# EAGLE schematic Mixed_signal_board (EAGLE 9.6.2)

## Sheet 1 of 7
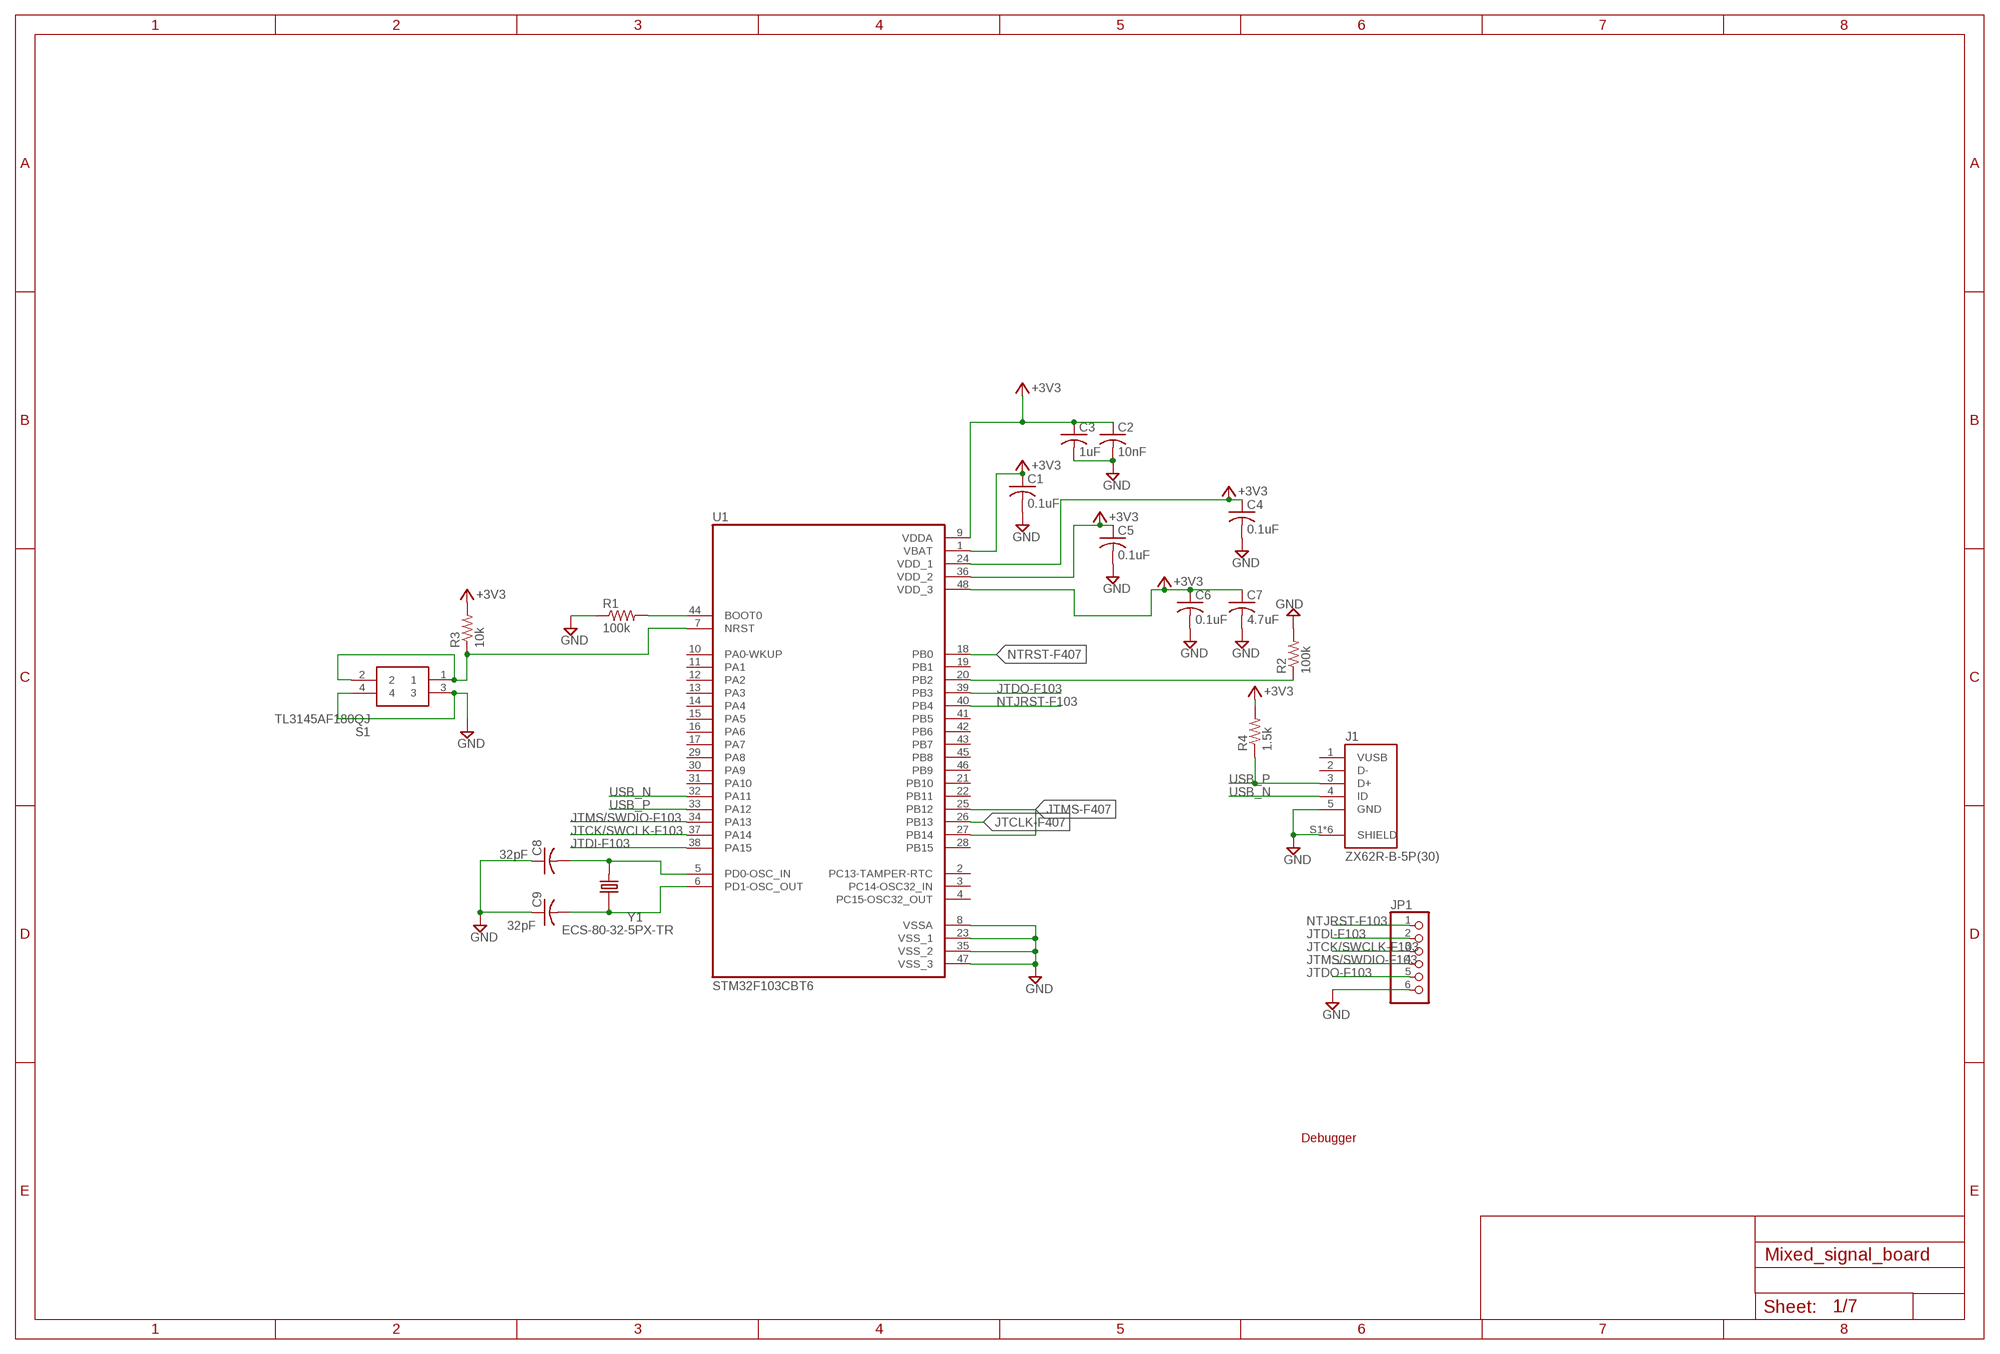
[diagram p0: schematic, sheet 1]

### Parts
C1  0.1uF  C-USC0805  [C0805]
C2  10nF  C-USC0805  [C0805]
C3  1uF  C-USC0805  [C0805]
C4  0.1uF  C-USC0805  [C0805]
C5  0.1uF  C-USC0805  [C0805]
C6  0.1uF  C-USC0805  [C0805]
C7  4.7uF  C-USC0805  [C0805]
C8  32pF  C-USC0805  [C0805]
C9  32pF  C-USC0805  [C0805]
J1  ZX62R-B-5P(30)  [HRS_ZX62R-B-5P(30)]
JP1  PINHD-1X6  [1X06]
R1  100k  R-US_R0805  [R0805]
R2  100k  R-US_R0805  [R0805]
R3  10k  R-US_R0805  [R0805]
R4  1.5k  R-US_R0805  [R0805]
S1  TL3145AF180QJ  [TL3145AF180QJ]
U1  STM32F103CBT6  [QFP50P900X900X160-48N]
Y1  ECS-80-32-5PX-TR  [XTAL_ECS-80-32-5PX-TR]

### Nets
+3V3: C1.1 C2.1 C3.1 C4.1 C5.1 C6.1 C7.1 R3.2 R4.2 U1.1(VBAT) U1.9(VDDA) U1.24(VDD_1) U1.36(VDD_2) U1.48(VDD_3) ; also sheet 2,3,4,5,6,7
GND: C1.2 C2.2 C3.2 C4.2 C5.2 C6.2 C7.2 C8.1 C9.1 J1.5(GND) J1.S1(SHIELD) J1.S2(SHIELD) J1.S3(SHIELD) J1.S4(SHIELD) J1.S5(SHIELD) J1.S6(SHIELD) JP1.6 R1.1 R2.2 S1.3 S1.4 U1.8(VSSA) U1.23(VSS_1) U1.35(VSS_2) U1.47(VSS_3) ; also sheet 2,3,4,5,6,7
JTCK/SWCLK-F103: JP1.3 U1.37(PA14)
JTCLK-F407: U1.26(PB13) ; also sheet 4
JTDI-F103: JP1.2 U1.38(PA15)
JTDO-F103: JP1.5 U1.39(PB3)
JTMS-F407: U1.25(PB12) U1.27(PB14) ; also sheet 4
JTMS/SWDIO-F103: JP1.4 U1.34(PA13)
N$1: R1.2 U1.44(BOOT0)
N$2: R2.1 U1.20(PB2)
N$3: C8.2 U1.5(PD0-OSC_IN) Y1.2
N$4: C9.2 U1.6(PD1-OSC_OUT) Y1.1
N$6: R3.1 S1.1 S1.2 U1.7(NRST)
NTJRST-F103: JP1.1 U1.40(PB4)
NTRST-F407: U1.18(PB0)
USB_N: J1.4(ID) U1.32(PA11)
USB_P: J1.3(D+) R4.1 U1.33(PA12)
Unconnected: J1.1(VUSB) J1.2(D-) U1.2(PC13-TAMPER-RTC) U1.3(PC14-OSC32_IN) U1.4(PC15-OSC32_OUT) U1.10(PA0-WKUP) U1.11(PA1) U1.12(PA2) U1.13(PA3) U1.14(PA4) U1.15(PA5) U1.16(PA6) U1.17(PA7) U1.19(PB1) U1.21(PB10) U1.22(PB11) U1.28(PB15) U1.29(PA8) U1.30(PA9) U1.31(PA10) U1.41(PB5) U1.42(PB6) U1.43(PB7) U1.45(PB8) U1.46(PB9)

### Notes on the sheet
- Debugger

## Sheet 2 of 7
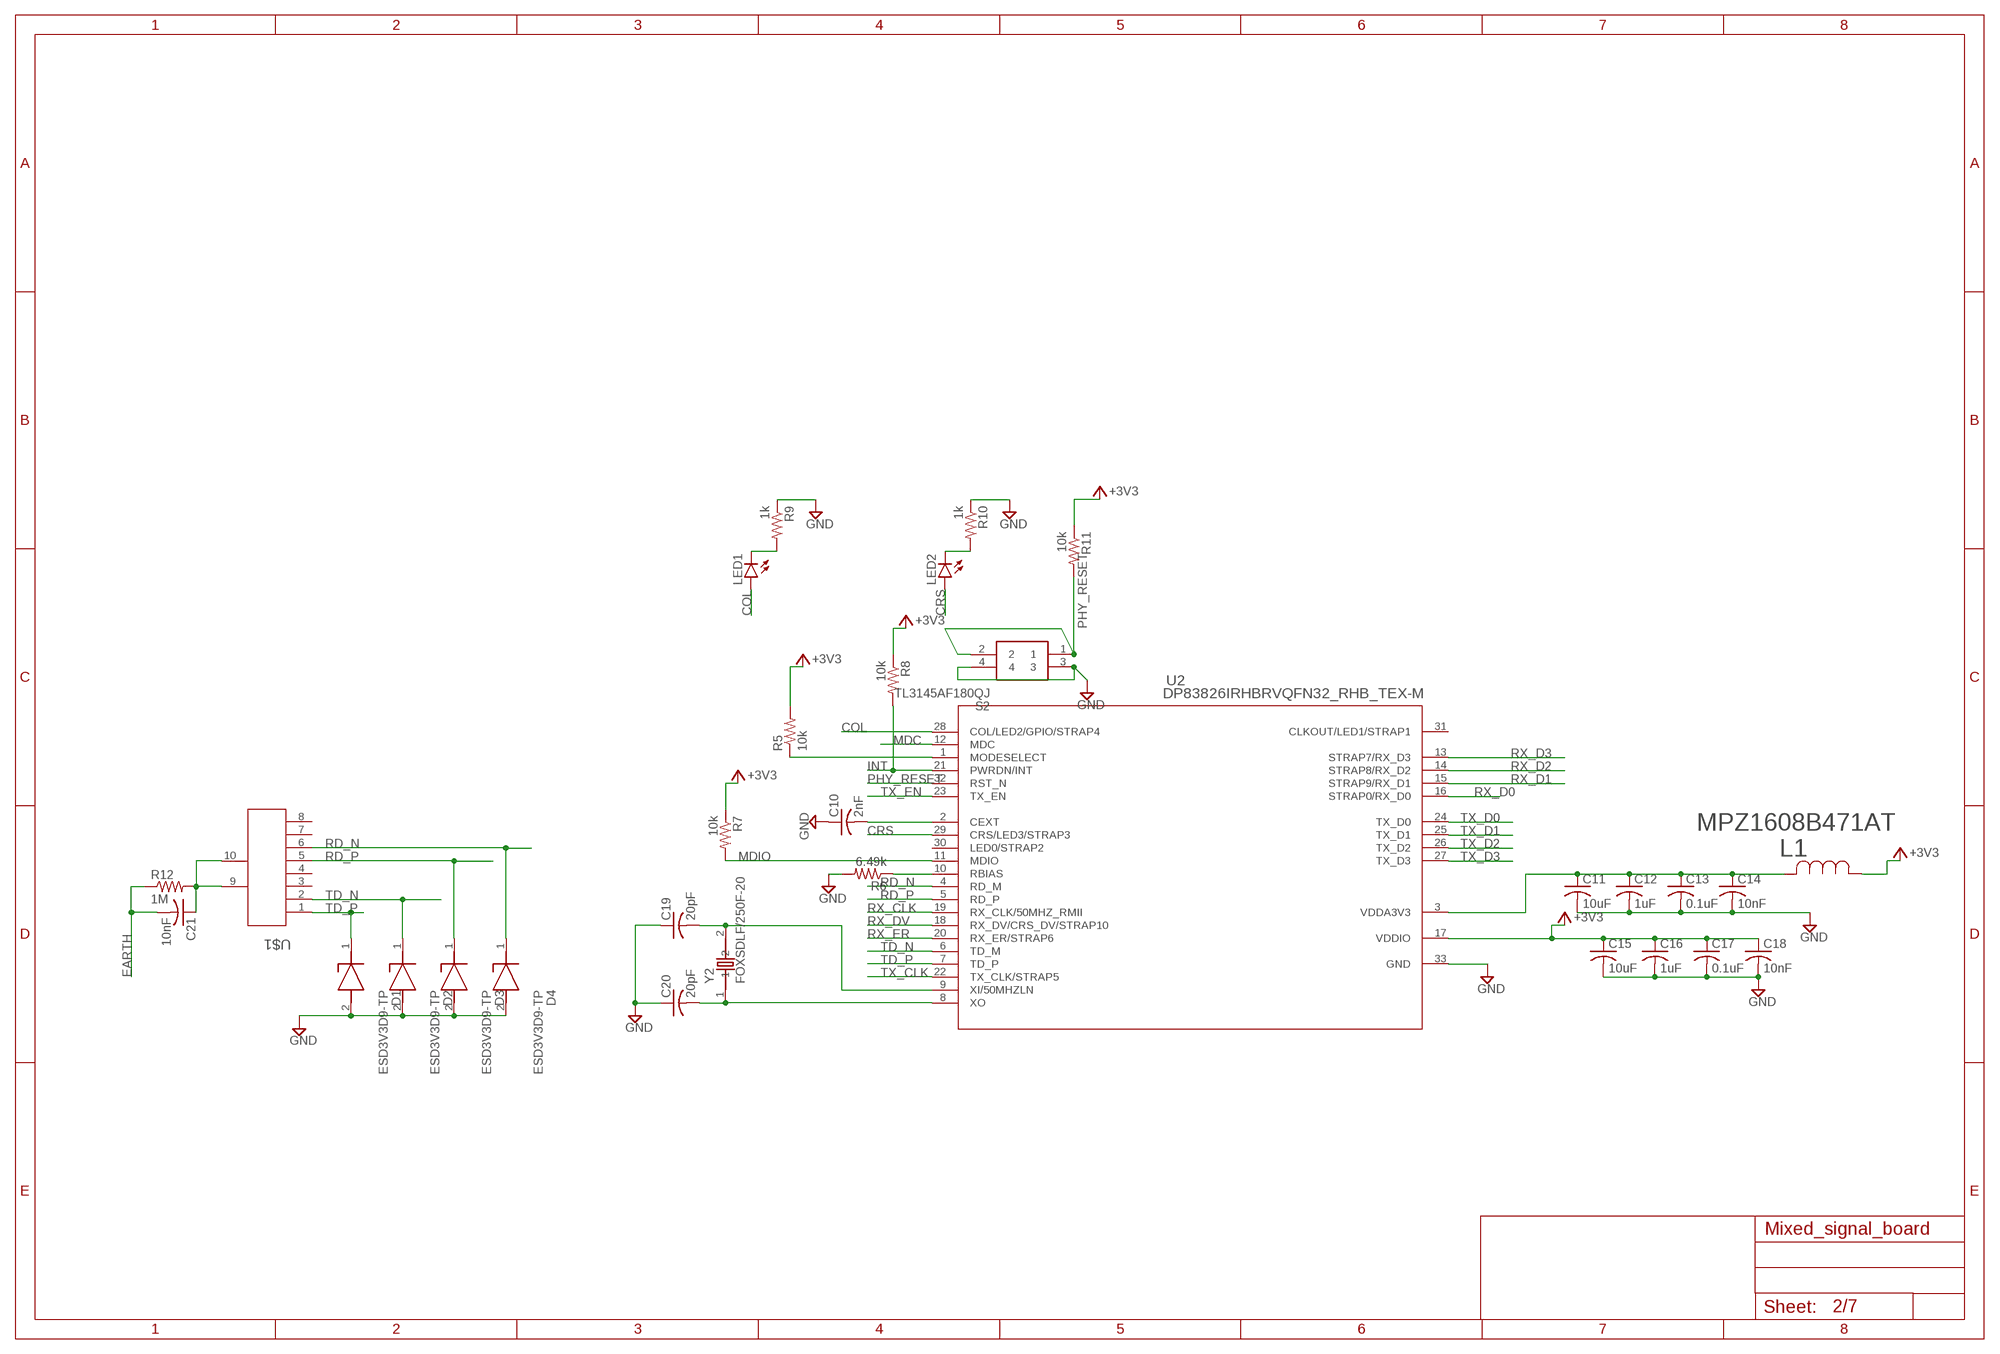
[diagram p1: schematic, sheet 2]

### Parts
C10  2nF  C-USC0805  [C0805]
C11  10uF  C-USC0805  [C0805]
C12  1uF  C-USC0805  [C0805]
C13  0.1uF  C-USC0805  [C0805]
C14  10nF  C-USC0805  [C0805]
C15  10uF  C-USC0805  [C0805]
C16  1uF  C-USC0805  [C0805]
C17  0.1uF  C-USC0805  [C0805]
C18  10nF  C-USC0805  [C0805]
C19  20pF  C-USC0805  [C0805]
C20  20pF  C-USC0805  [C0805]
C21  10nF  C-USC0805  [C0805]
D1  ESD3V3D9-TP  [SODFL1006X43N]
D2  ESD3V3D9-TP  [SODFL1006X43N]
D3  ESD3V3D9-TP  [SODFL1006X43N]
D4  ESD3V3D9-TP  [SODFL1006X43N]
L1  MPZ1608B471AT  [IND_MPZ1608_TDK]
LED1  LEDCHIPLED_0805  [CHIPLED_0805]
LED2  LEDCHIPLED_0805  [CHIPLED_0805]
R5  10k  R-US_R0805  [R0805]
R6  6.49k  R-US_R0805  [R0805]
R7  10k  R-US_R0805  [R0805]
R8  10k  R-US_R0805  [R0805]
R9  1k  R-US_R0805  [R0805]
R10  1k  R-US_R0805  [R0805]
R11  10k  R-US_R0805  [R0805]
R12  1M  R-US_R0805  [R0805]
S2  TL3145AF180QJ  [TL3145AF180QJ]
U2  DP83826IRHBRVQFN32_RHB_TEX-M  [VQFN32_RHB_TEX-M]
U$1  RJ-45  [CONN_RJSBE5080_16P13X12P57_AMP]
Y2  FOXSDLF/250F-20  [XTAL1170X500X450]

### Nets
+3V3: C15.1 C16.1 C17.1 C18.1 L1.1 R5.2 R7.1 R8.1 R11.1 U2.17(VDDIO) ; also sheet 1,3,4,5,6,7
COL: LED1.A U2.28(COL/LED2/GPIO/STRAP4) ; also sheet 4
CRS: LED2.A U2.29(CRS/LED3/STRAP3) ; also sheet 4
EARTH: C21.2 R12.1 ; also sheet 7
GND: C10.1 C11.2 C12.2 C13.2 C14.2 C15.2 C16.2 C17.2 C18.2 C19.1 C20.1 D1.2(A) D2.2(A) D3.2(A) D4.2(A) R6.2 R9.1 R10.1 S2.3 S2.4 U2.33(GND) ; also sheet 1,3,4,5,6,7
INT [50ohm]: R8.2 U2.21(PWRDN/INT)
MDC: U2.12(MDC) ; also sheet 4
MDIO: R7.2 U2.11(MDIO) ; also sheet 4
N$5: R5.1 U2.1(MODESELECT)
N$7: C10.2 U2.2(CEXT)
N$8: C11.1 C12.1 C13.1 C14.1 L1.2 U2.3(VDDA3V3)
N$9: C19.2 U2.9(XI/50MHZLN) Y2.2
N$10: C20.2 U2.8(XO) Y2.1
N$11: R6.1 U2.10(RBIAS)
N$12: C21.1 R12.2 U$1.9(EARTH) U$1.10(EARTH2)
N$13: LED1.C R9.2
N$14: LED2.C R10.2
PHY_RESET: R11.2 S2.1 S2.2 U2.32(RST_N) ; also sheet 4
RD_N: D4.1(K) U2.4(RD_M) U$1.6(D3-)
RD_P: D3.1(K) U2.5(RD_P) U$1.5(D3+)
RX_CLK [50ohm]: U2.19(RX_CLK/50MHZ_RMII) ; also sheet 4
RX_D0 [50ohm]: U2.16(STRAP0/RX_D0) ; also sheet 4
RX_D1 [50ohm]: U2.15(STRAP9/RX_D1) ; also sheet 4
RX_D2 [50ohm]: U2.14(STRAP8/RX_D2) ; also sheet 4
RX_D3 [50ohm]: U2.13(STRAP7/RX_D3) ; also sheet 4
RX_DV [50ohm]: U2.18(RX_DV/CRS_DV/STRAP10) ; also sheet 4
RX_ER [50ohm]: U2.20(RX_ER/STRAP6)
TD_N: D2.1(K) U2.6(TD_M) U$1.2(D1-)
TD_P: D1.1(K) U2.7(TD_P) U$1.1(D1+)
TX_CLK [50ohm]: U2.22(TX_CLK/STRAP5) ; also sheet 4
TX_D0 [50ohm]: U2.24(TX_D0) ; also sheet 4
TX_D1 [50ohm]: U2.25(TX_D1) ; also sheet 4
TX_D2 [50ohm]: U2.26(TX_D2) ; also sheet 4
TX_D3 [50ohm]: U2.27(TX_D3) ; also sheet 4
TX_EN [50ohm]: U2.23(TX_EN) ; also sheet 4
Unconnected: U2.30(LED0/STRAP2) U2.31(CLKOUT/LED1/STRAP1) U$1.3(D2+) U$1.4(D2-) U$1.7(D4+) U$1.8(D4-)

## Sheet 3 of 7
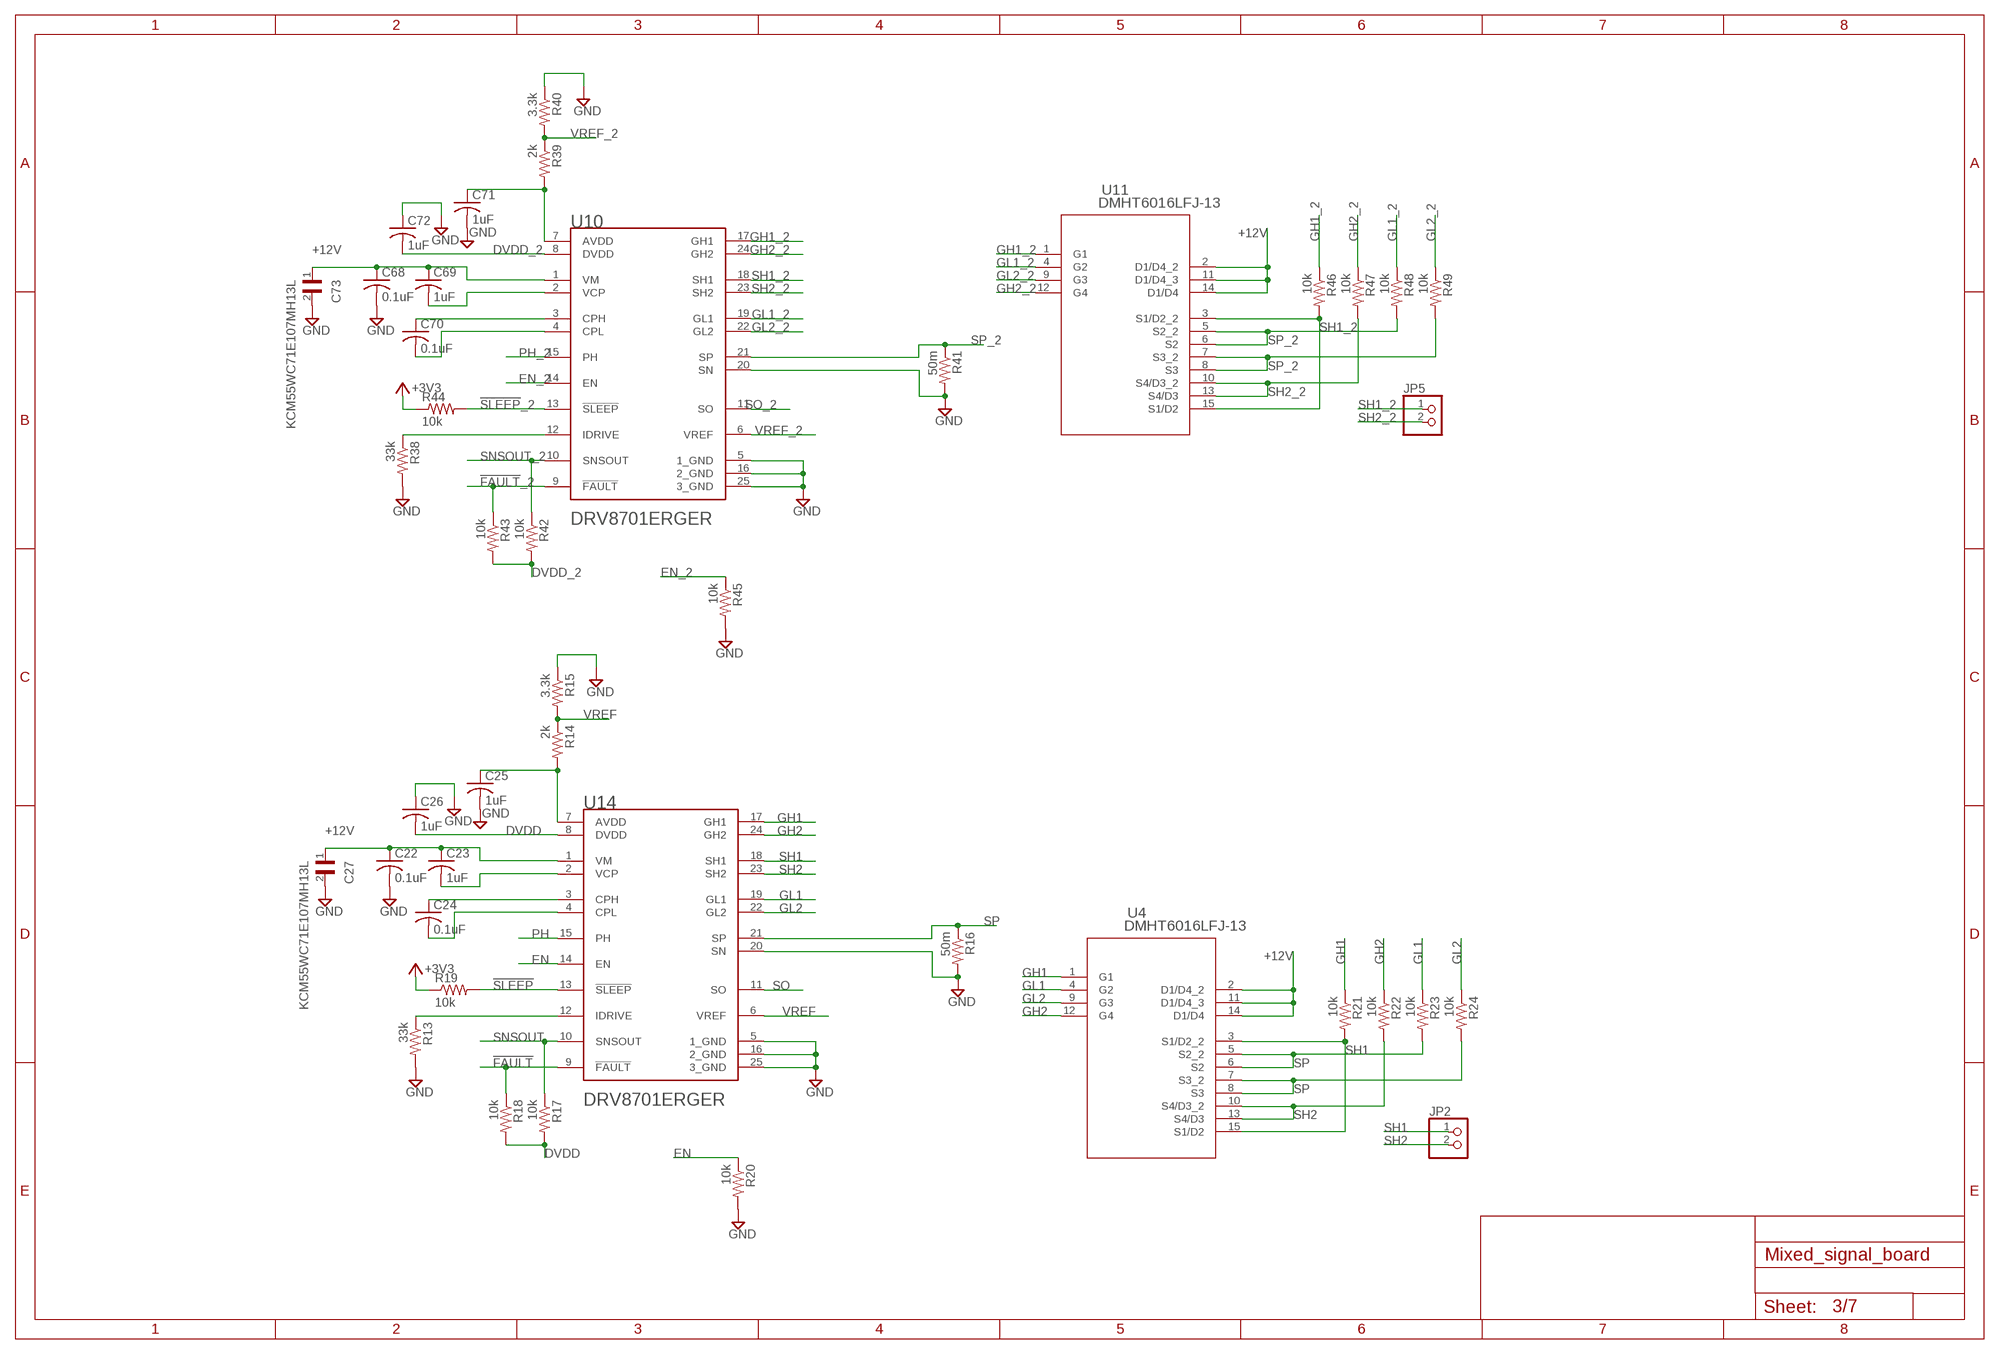
[diagram p2: schematic, sheet 3]

### Parts
C22  0.1uF  C-USC0805  [C0805]
C23  1uF  C-USC0805  [C0805]
C24  0.1uF  C-USC0805  [C0805]
C25  1uF  C-USC0805  [C0805]
C26  1uF  C-USC0805  [C0805]
C27  KCM55WC71E107MH13L  [CAPC6153X670N]
C68  0.1uF  C-USC0805  [C0805]
C69  1uF  C-USC0805  [C0805]
C70  0.1uF  C-USC0805  [C0805]
C71  1uF  C-USC0805  [C0805]
C72  1uF  C-USC0805  [C0805]
C73  KCM55WC71E107MH13L  [CAPC6153X670N]
JP2  PINHD-1X2  [1X02]
JP5  PINHD-1X2  [1X02]
R13  33k  R-US_R0805  [R0805]
R14  2k  R-US_R0805  [R0805]
R15  3.3k  R-US_R0805  [R0805]
R16  50m  R-US_R0805  [R0805]
R17  10k  R-US_R0805  [R0805]
R18  10k  R-US_R0805  [R0805]
R19  10k  R-US_R0805  [R0805]
R20  10k  R-US_R0805  [R0805]
R21  10k  R-US_R0805  [R0805]
R22  10k  R-US_R0805  [R0805]
R23  10k  R-US_R0805  [R0805]
R24  10k  R-US_R0805  [R0805]
R38  33k  R-US_R0805  [R0805]
R39  2k  R-US_R0805  [R0805]
R40  3.3k  R-US_R0805  [R0805]
R41  50m  R-US_R0805  [R0805]
R42  10k  R-US_R0805  [R0805]
R43  10k  R-US_R0805  [R0805]
R44  10k  R-US_R0805  [R0805]
R45  10k  R-US_R0805  [R0805]
R46  10k  R-US_R0805  [R0805]
R47  10k  R-US_R0805  [R0805]
R48  10k  R-US_R0805  [R0805]
R49  10k  R-US_R0805  [R0805]
U4  DMHT6016LFJ-13  [QFN_LFJ-13_DIO]
U10  TEXAS_INSTRUMENTS_DRV8701ERGERTEXAS_INSTRUMENTS_DRV8701ERGER_0_0  [TEXAS_INSTRUMENTS_DRV8701ERGER_0]
U11  DMHT6016LFJ-13  [QFN_LFJ-13_DIO]
U14  TEXAS_INSTRUMENTS_DRV8701ERGERTEXAS_INSTRUMENTS_DRV8701ERGER_0_0  [TEXAS_INSTRUMENTS_DRV8701ERGER_0]

### Nets
!FAULT!: R18.1 U14.9(!FAULT!) ; also sheet 4
!FAULT!_2: R43.1 U10.9(!FAULT!) ; also sheet 4
!SLEEP!: R19.2 U14.13(!SLEEP!)
!SLEEP!_2: R44.2 U10.13(!SLEEP!)
+3V3: R19.1 R44.1 ; also sheet 1,2,4,5,6,7
+12V: C22.1 C23.1 C27.1 C68.1 C69.1 C73.1 U4.2(D1/D4_2) U4.11(D1/D4_3) U4.14(D1/D4) U10.1(VM) U11.2(D1/D4_2) U11.11(D1/D4_3) U11.14(D1/D4) U14.1(VM) ; also sheet 7
DVDD: C26.2 R17.2 R18.2 U14.8(DVDD)
DVDD_2: C72.2 R42.2 R43.2 U10.8(DVDD)
EN: R20.1 U14.14(EN) ; also sheet 4
EN_2: R45.1 U10.14(EN) ; also sheet 4
GH1: R21.1 U4.1(G1) U14.17(GH1)
GH1_2: R46.1 U10.17(GH1) U11.1(G1)
GH2: R22.1 U4.12(G4) U14.24(GH2)
GH2_2: R47.1 U10.24(GH2) U11.12(G4)
GL1: R23.1 U4.4(G2) U14.19(GL1)
GL1_2: R48.1 U10.19(GL1) U11.4(G2)
GL2: R24.1 U4.9(G3) U14.22(GL2)
GL2_2: R49.1 U10.22(GL2) U11.9(G3)
GND: C22.2 C25.2 C26.1 C27.2 C68.2 C71.2 C72.1 C73.2 R13.2 R15.1 R16.2 R20.2 R38.2 R40.1 R41.2 R45.2 U10.5(1_GND) U10.16(2_GND) U10.20(SN) U10.25(3_GND) U14.5(1_GND) U14.16(2_GND) U14.20(SN) U14.25(3_GND) ; also sheet 1,2,4,5,6,7
N$16: C23.2 U14.2(VCP)
N$17: C24.1 U14.3(CPH)
N$18: C24.2 U14.4(CPL)
N$19: R13.1 U14.12(IDRIVE)
N$20: C25.1 R14.2 U14.7(AVDD)
N$39: C69.2 U10.2(VCP)
N$40: C70.1 U10.3(CPH)
N$41: C70.2 U10.4(CPL)
N$42: R38.1 U10.12(IDRIVE)
N$43: C71.1 R39.2 U10.7(AVDD)
PH: U14.15(PH) ; also sheet 4
PH_2: U10.15(PH) ; also sheet 4
SH1: JP2.1 R21.2 U4.3(S1/D2_2) U4.15(S1/D2) U14.18(SH1)
SH1_2: JP5.1 R46.2 U10.18(SH1) U11.3(S1/D2_2) U11.15(S1/D2)
SH2: JP2.2 R22.2 U4.10(S4/D3_2) U4.13(S4/D3) U14.23(SH2)
SH2_2: JP5.2 R47.2 U10.23(SH2) U11.10(S4/D3_2) U11.13(S4/D3)
SNSOUT: R17.1 U14.10(SNSOUT) ; also sheet 4
SNSOUT_2: R42.1 U10.10(SNSOUT) ; also sheet 4
SO: U14.11(SO) ; also sheet 4
SO_2: U10.11(SO) ; also sheet 4
SP: R16.1 R23.2 R24.2 U4.5(S2_2) U4.6(S2) U4.7(S3_2) U4.8(S3) U14.21(SP)
SP_2: R41.1 R48.2 R49.2 U10.21(SP) U11.5(S2_2) U11.6(S2) U11.7(S3_2) U11.8(S3)
VREF: R14.1 R15.2 U14.6(VREF)
VREF_2: R39.1 R40.2 U10.6(VREF)

## Sheet 4 of 7
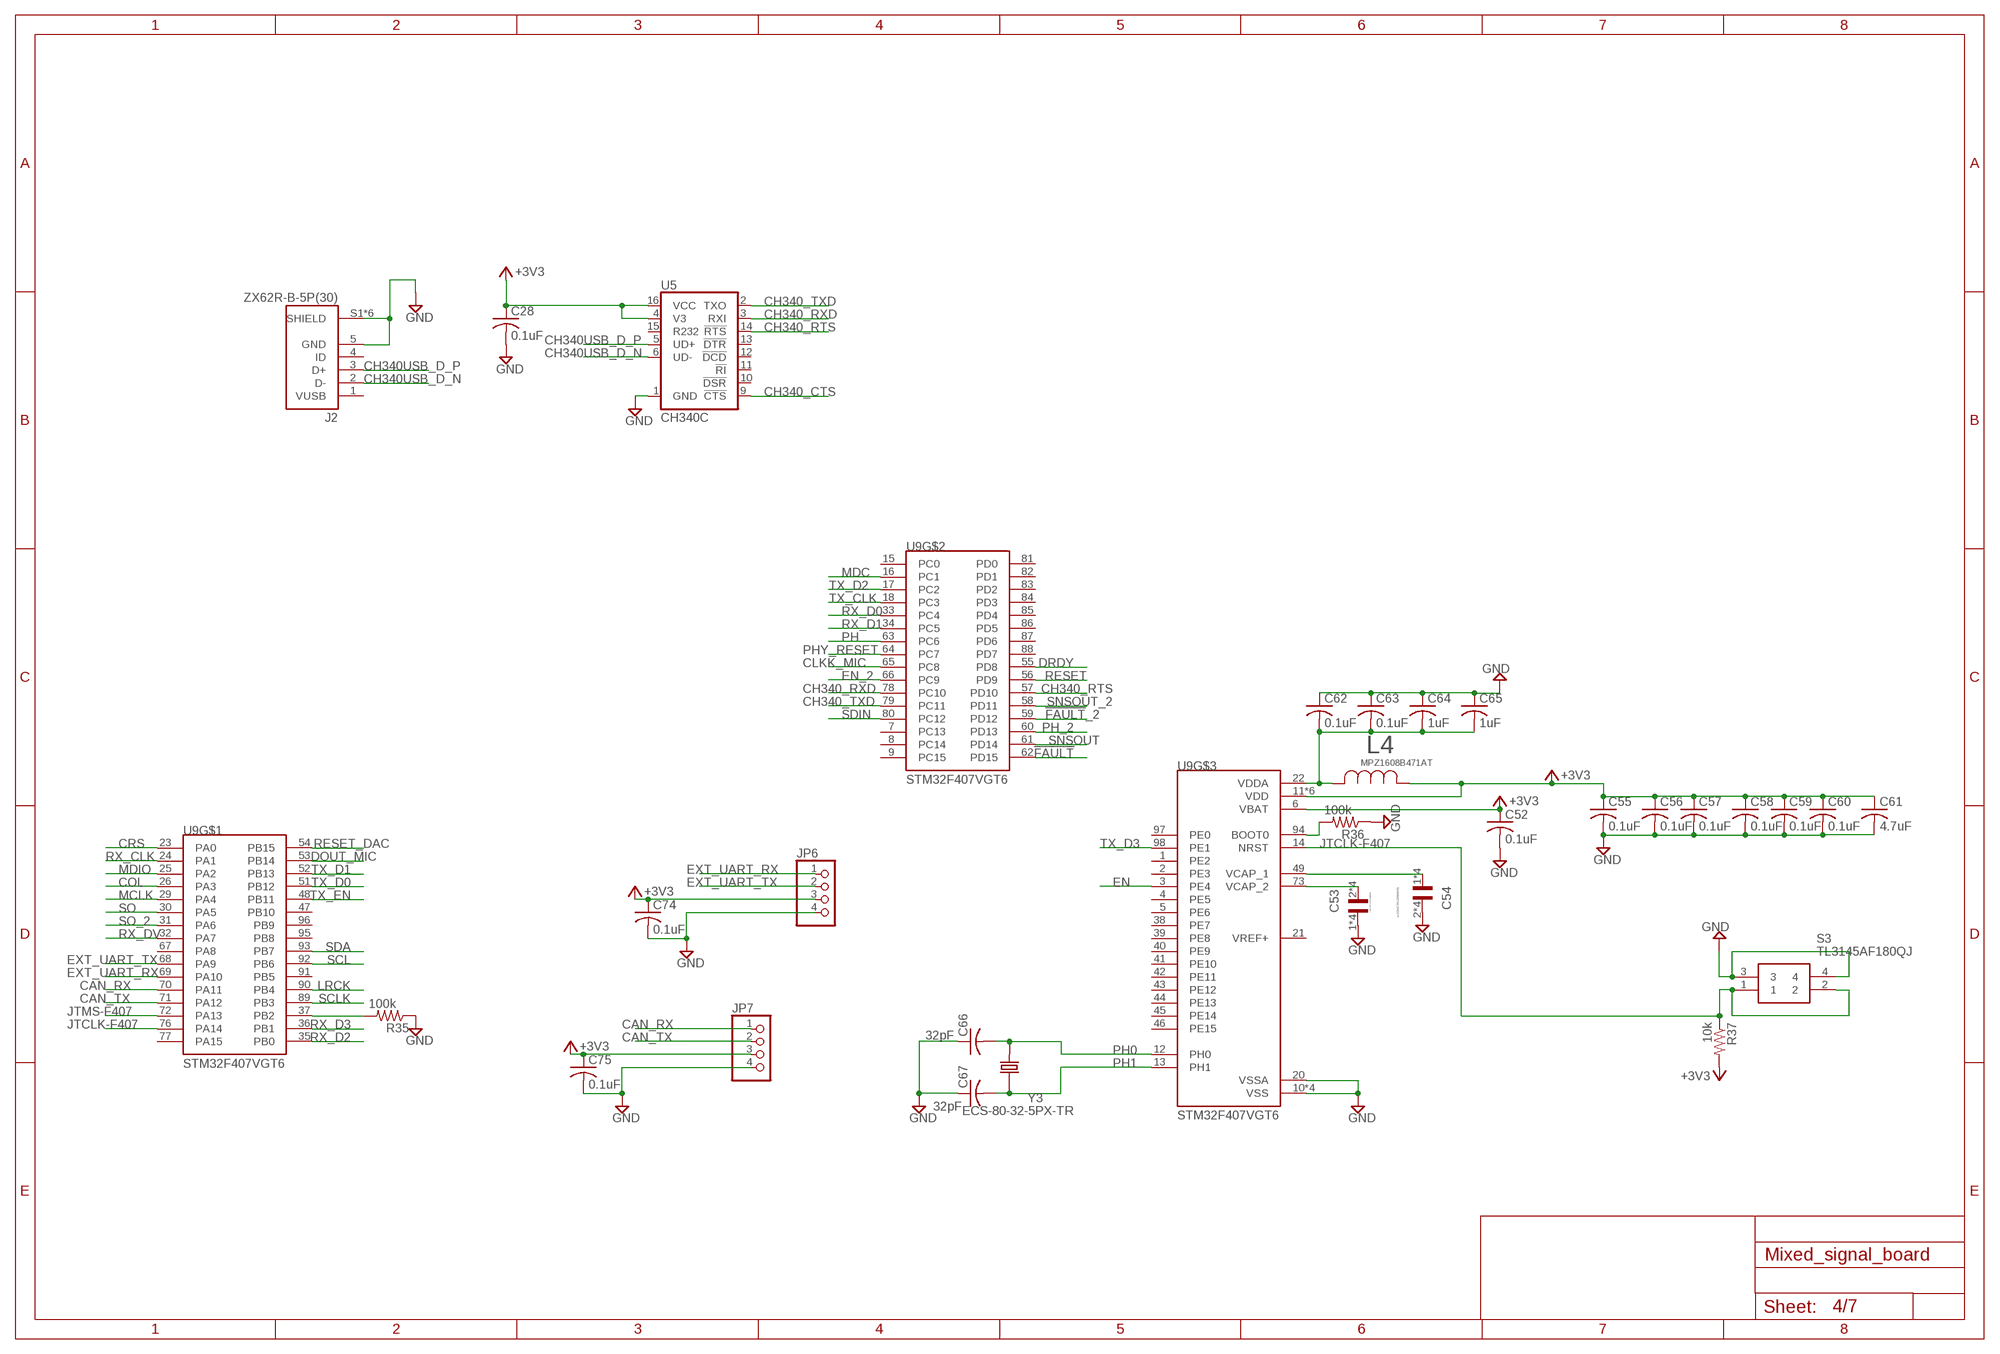
[diagram p3: schematic, sheet 4]

### Parts
C28  0.1uF  C-USC0805  [C0805]
C52  0.1uF  C-USC0805  [C0805]
C53  LLA219C70G225MA01L  [CAP_LLA219C70G225MA01L]
C54  LLA219C70G225MA01L  [CAP_LLA219C70G225MA01L]
C55  0.1uF  C-USC0805  [C0805]
C56  0.1uF  C-USC0805  [C0805]
C57  0.1uF  C-USC0805  [C0805]
C58  0.1uF  C-USC0805  [C0805]
C59  0.1uF  C-USC0805  [C0805]
C60  0.1uF  C-USC0805  [C0805]
C61  4.7uF  C-USC0805  [C0805]
C62  0.1uF  C-USC0805  [C0805]
C63  0.1uF  C-USC0805  [C0805]
C64  1uF  C-USC0805  [C0805]
C65  1uF  C-USC0805  [C0805]
C66  32pF  C-USC0805  [C0805]
C67  32pF  C-USC0805  [C0805]
C74  0.1uF  C-USC0805  [C0805]
C75  0.1uF  C-USC0805  [C0805]
J2  ZX62R-B-5P(30)  [HRS_ZX62R-B-5P(30)]
JP6  PINHD-1X4  [1X04]
JP7  PINHD-1X4  [1X04]
L4  MPZ1608B471AT  [IND_MPZ1608_TDK]
R35  100k  R-US_R0805  [R0805]
R36  100k  R-US_R0805  [R0805]
R37  10k  R-US_R0805  [R0805]
S3  TL3145AF180QJ  [TL3145AF180QJ]
U5  CH340C  [SO016]
U9  STM32F407VGT6  [QFP50P1600X1600X160-100N]
Y3  ECS-80-32-5PX-TR  [XTAL_ECS-80-32-5PX-TR]

### Nets
!FAULT!: U9.62(PD15) ; also sheet 3
!FAULT!_2: U9.59(PD12) ; also sheet 3
+3V3: C28.1 C52.1 C55.1 C56.1 C57.1 C58.1 C59.1 C60.1 C61.1 C74.1 C75.1 JP6.3 JP7.3 L4.1 R37.2 U5.4(V3) U5.16(VCC) U9.6(VBAT) U9.11(VDD) U9.19(VDD) U9.28(VDD) U9.50(VDD) U9.75(VDD) U9.100(VDD) ; also sheet 1,2,3,5,6,7
CAN_RX: JP7.1 U9.70(PA11)
CAN_TX: JP7.2 U9.71(PA12)
CH340_CTS: U5.9(!CTS)
CH340_RTS: U5.14(!RTS) U9.57(PD10)
CH340_RXD: U5.3(RXI) U9.78(PC10)
CH340_TXD: U5.2(TXO) U9.79(PC11)
CH340USB_D_N: J2.2(D-) U5.6(UD-) ; also sheet 5
CH340USB_D_P: J2.3(D+) U5.5(UD+) ; also sheet 5
CLKK_MIC: U9.65(PC8) ; also sheet 6
COL: U9.26(PA3) ; also sheet 2
CRS: U9.23(PA0) ; also sheet 2
DOUT_MIC: U9.53(PB14) ; also sheet 6
DRDY: U9.55(PD8) ; also sheet 5
EN: U9.3(PE4) ; also sheet 3
EN_2: U9.66(PC9) ; also sheet 3
EXT_UART_RX: JP6.1 U9.69(PA10)
EXT_UART_TX: JP6.2 U9.68(PA9)
GND: C28.2 C52.2 C53.1 C53.3 C53.5 C53.7 C54.2 C54.4 C54.6 C54.8 C55.2 C56.2 C57.2 C58.2 C59.2 C60.2 C61.2 C62.1 C63.1 C64.1 C65.1 C66.1 C67.1 C74.2 C75.2 J2.5(GND) J2.S1(SHIELD) J2.S2(SHIELD) J2.S3(SHIELD) J2.S4(SHIELD) J2.S5(SHIELD) J2.S6(SHIELD) JP6.4 JP7.4 R35.1 R36.1 S3.3 S3.4 U5.1(GND) U9.10(VSS) U9.20(VSSA) U9.27(VSS) U9.74(VSS) U9.99(VSS) ; also sheet 1,2,3,5,6,7
JTCLK-F407: R37.1 S3.1 S3.2 U9.14(NRST) U9.76(PA14) ; also sheet 1
JTMS-F407: U9.72(PA13) ; also sheet 1
LRCK: U9.90(PB4) ; also sheet 6
MCLK: U9.29(PA4) ; also sheet 6
MDC: U9.16(PC1) ; also sheet 2
MDIO: U9.25(PA2) ; also sheet 2
N$34: R36.2 U9.94(BOOT0)
N$35: C54.1 C54.3 C54.5 C54.7 U9.49(VCAP_1)
N$36: C53.2 C53.4 C53.6 C53.8 U9.73(VCAP_2)
N$37: C62.2 C63.2 C64.2 C65.2 L4.2 U9.22(VDDA)
N$46: R35.2 U9.37(PB2)
PH: U9.63(PC6) ; also sheet 3
PH0: C66.2 U9.12(PH0) Y3.2
PH1: C67.2 U9.13(PH1) Y3.1
PH_2: U9.60(PD13) ; also sheet 3
PHY_RESET: U9.64(PC7) ; also sheet 2
RESET: U9.56(PD9) ; also sheet 5
RESET_DAC: U9.54(PB15) ; also sheet 6
RX_CLK [50ohm]: U9.24(PA1) ; also sheet 2
RX_D0 [50ohm]: U9.33(PC4) ; also sheet 2
RX_D1 [50ohm]: U9.34(PC5) ; also sheet 2
RX_D2 [50ohm]: U9.35(PB0) ; also sheet 2
RX_D3 [50ohm]: U9.36(PB1) ; also sheet 2
RX_DV [50ohm]: U9.32(PA7) ; also sheet 2
SCL: U9.92(PB6) ; also sheet 5,6
SCLK: U9.89(PB3) ; also sheet 6
SDA: U9.93(PB7) ; also sheet 5,6
SDIN: U9.80(PC12) ; also sheet 6
SNSOUT: U9.61(PD14) ; also sheet 3
SNSOUT_2: U9.58(PD11) ; also sheet 3
SO: U9.30(PA5) ; also sheet 3
SO_2: U9.31(PA6) ; also sheet 3
TX_CLK [50ohm]: U9.18(PC3) ; also sheet 2
TX_D0 [50ohm]: U9.51(PB12) ; also sheet 2
TX_D1 [50ohm]: U9.52(PB13) ; also sheet 2
TX_D2 [50ohm]: U9.17(PC2) ; also sheet 2
TX_D3 [50ohm]: U9.98(PE1) ; also sheet 2
TX_EN [50ohm]: U9.48(PB11) ; also sheet 2
Unconnected: J2.1(VUSB) J2.4(ID) U5.10(!DSR) U5.11(!RI) U5.12(!DCD) U5.13(!DTR) U5.15(R232) U9.1(PE2) U9.2(PE3) U9.4(PE5) U9.5(PE6) U9.7(PC13) U9.8(PC14) U9.9(PC15) U9.15(PC0) U9.38(PE7) U9.39(PE8) U9.40(PE9) U9.41(PE10) U9.42(PE11) U9.43(PE12) U9.44(PE13) U9.45(PE14) U9.46(PE15) U9.47(PB10) U9.67(PA8) U9.77(PA15) U9.81(PD0) U9.82(PD1) U9.83(PD2) U9.84(PD3) U9.85(PD4) U9.86(PD5) U9.87(PD6) U9.88(PD7) U9.91(PB5) U9.95(PB8) U9.96(PB9) U9.97(PE0)

## Sheet 5 of 7
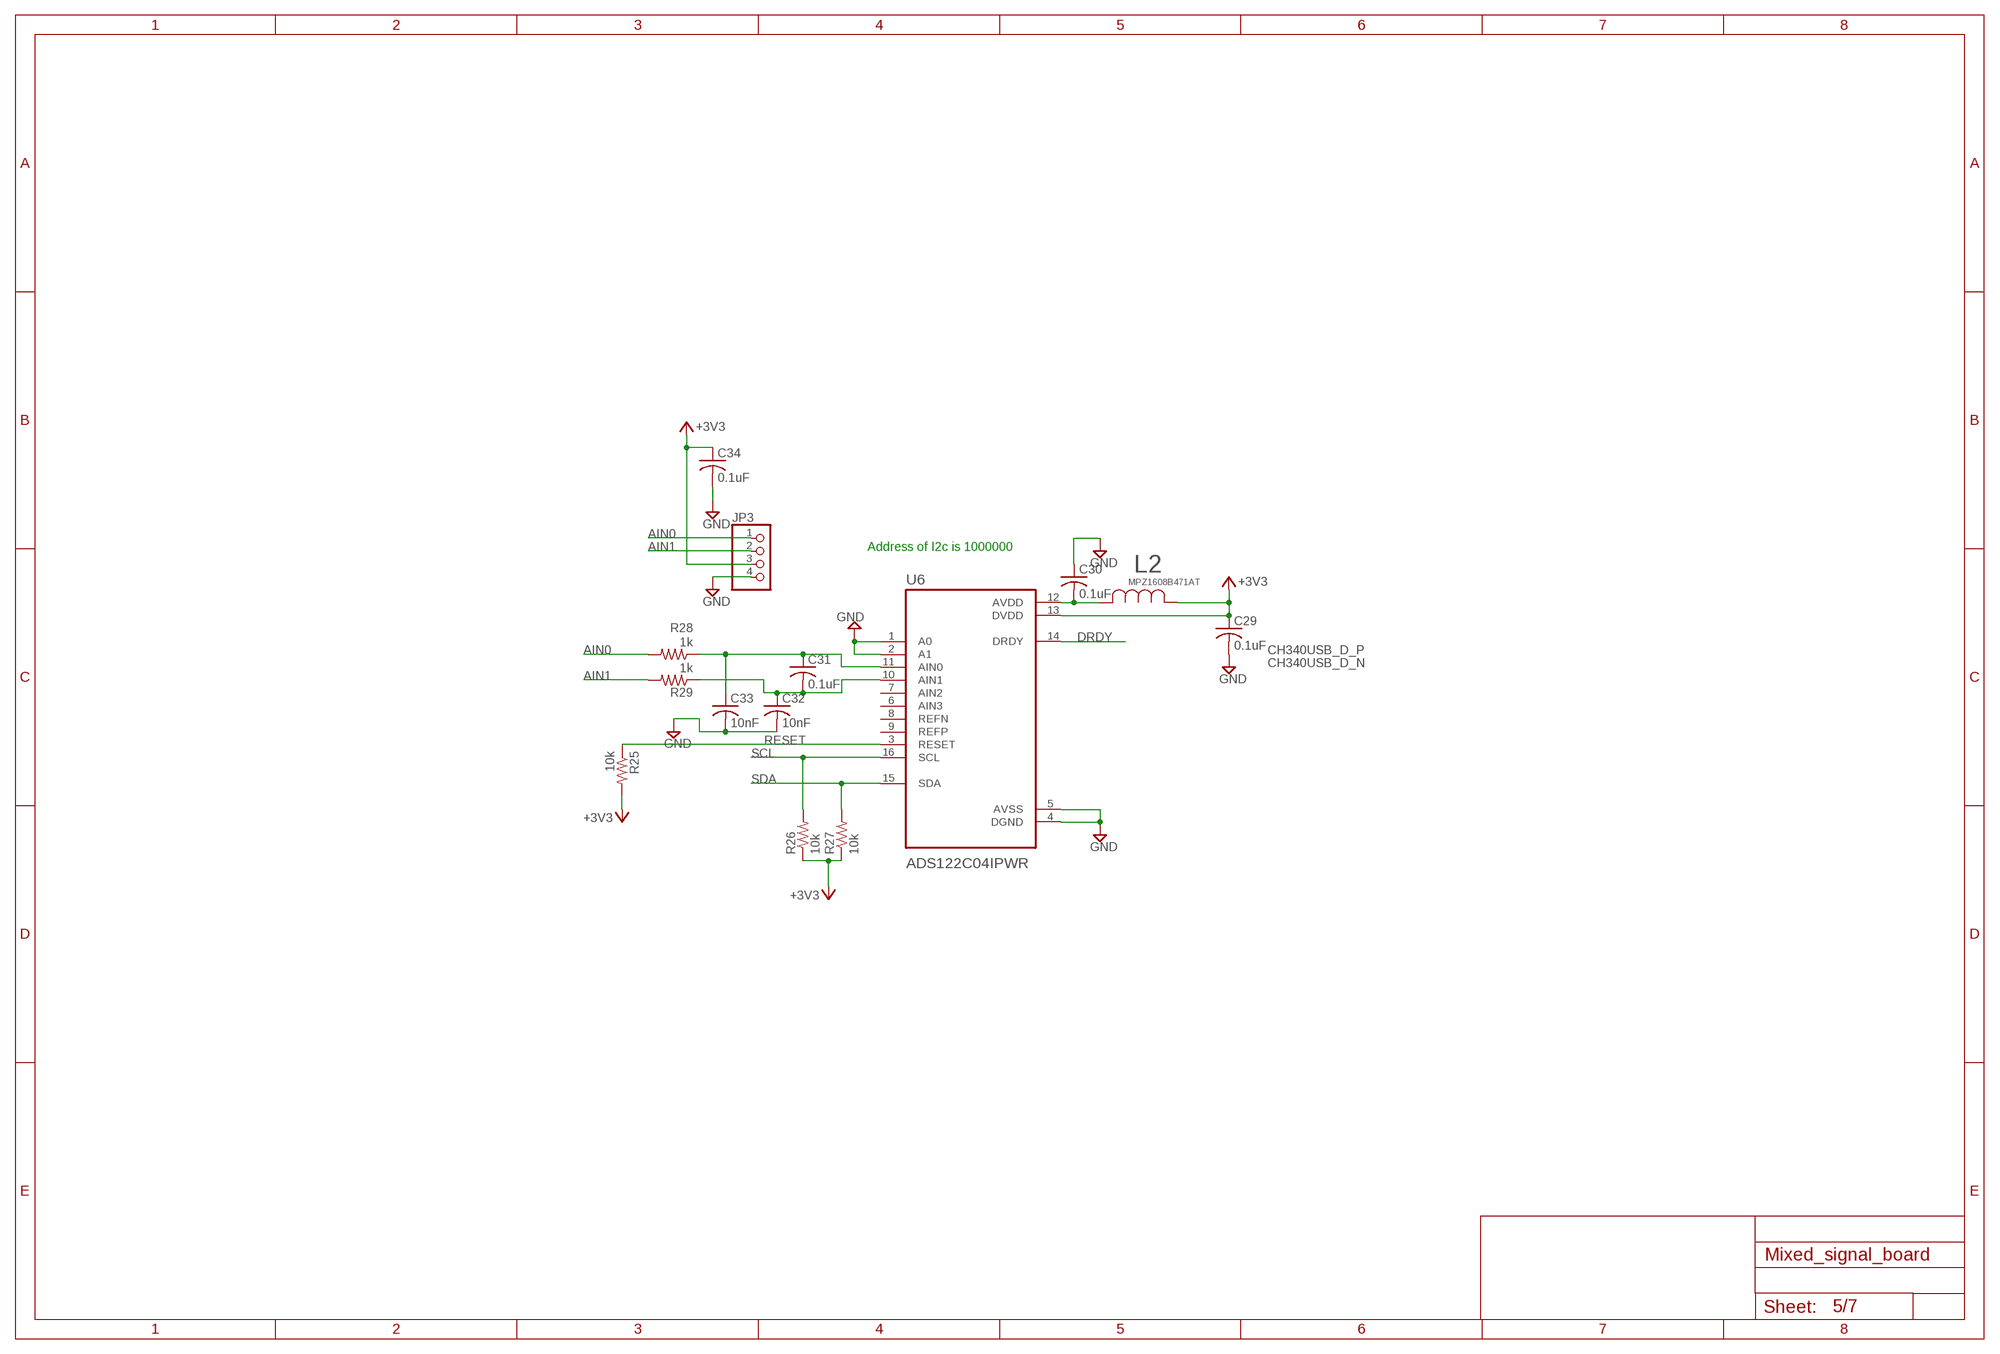
[diagram p4: schematic, sheet 5]

### Parts
C29  0.1uF  C-USC0805  [C0805]
C30  0.1uF  C-USC0805  [C0805]
C31  0.1uF  C-USC0805  [C0805]
C32  10nF  C-USC0805  [C0805]
C33  10nF  C-USC0805  [C0805]
C34  0.1uF  C-USC0805  [C0805]
JP3  PINHD-1X4  [1X04]
L2  MPZ1608B471AT  [IND_MPZ1608_TDK]
R25  10k  R-US_R0805  [R0805]
R26  10k  R-US_R0805  [R0805]
R27  10k  R-US_R0805  [R0805]
R28  1k  R-US_R0805  [R0805]
R29  1k  R-US_R0805  [R0805]
U6  ADS122C04IPWR  [SOP65P640X120-16N]

### Nets
+3V3: C29.1 C34.1 JP3.3 L2.1 R25.2 R26.1 R27.1 U6.13(DVDD) ; also sheet 1,2,3,4,6,7
AIN0: JP3.1 R28.2
AIN1: JP3.2 R29.2
DRDY: U6.14(DRDY) ; also sheet 4
GND: C29.2 C30.1 C32.2 C33.2 C34.2 JP3.4 U6.1(A0) U6.2(A1) U6.4(DGND) U6.5(AVSS) ; also sheet 1,2,3,4,6,7
N$21: C30.2 L2.2 U6.12(AVDD)
N$22: C31.1 C33.1 R28.1 U6.11(AIN0)
N$23: C31.2 C32.1 R29.1 U6.10(AIN1)
RESET: R25.1 U6.3(RESET) ; also sheet 4
SCL: R26.2 U6.16(SCL) ; also sheet 4,6
SDA: R27.2 U6.15(SDA) ; also sheet 4,6
Unconnected: U6.6(AIN3) U6.7(AIN2) U6.8(REFN) U6.9(REFP)

### Notes on the sheet
- Address of I2c is 1000000

## Sheet 6 of 7
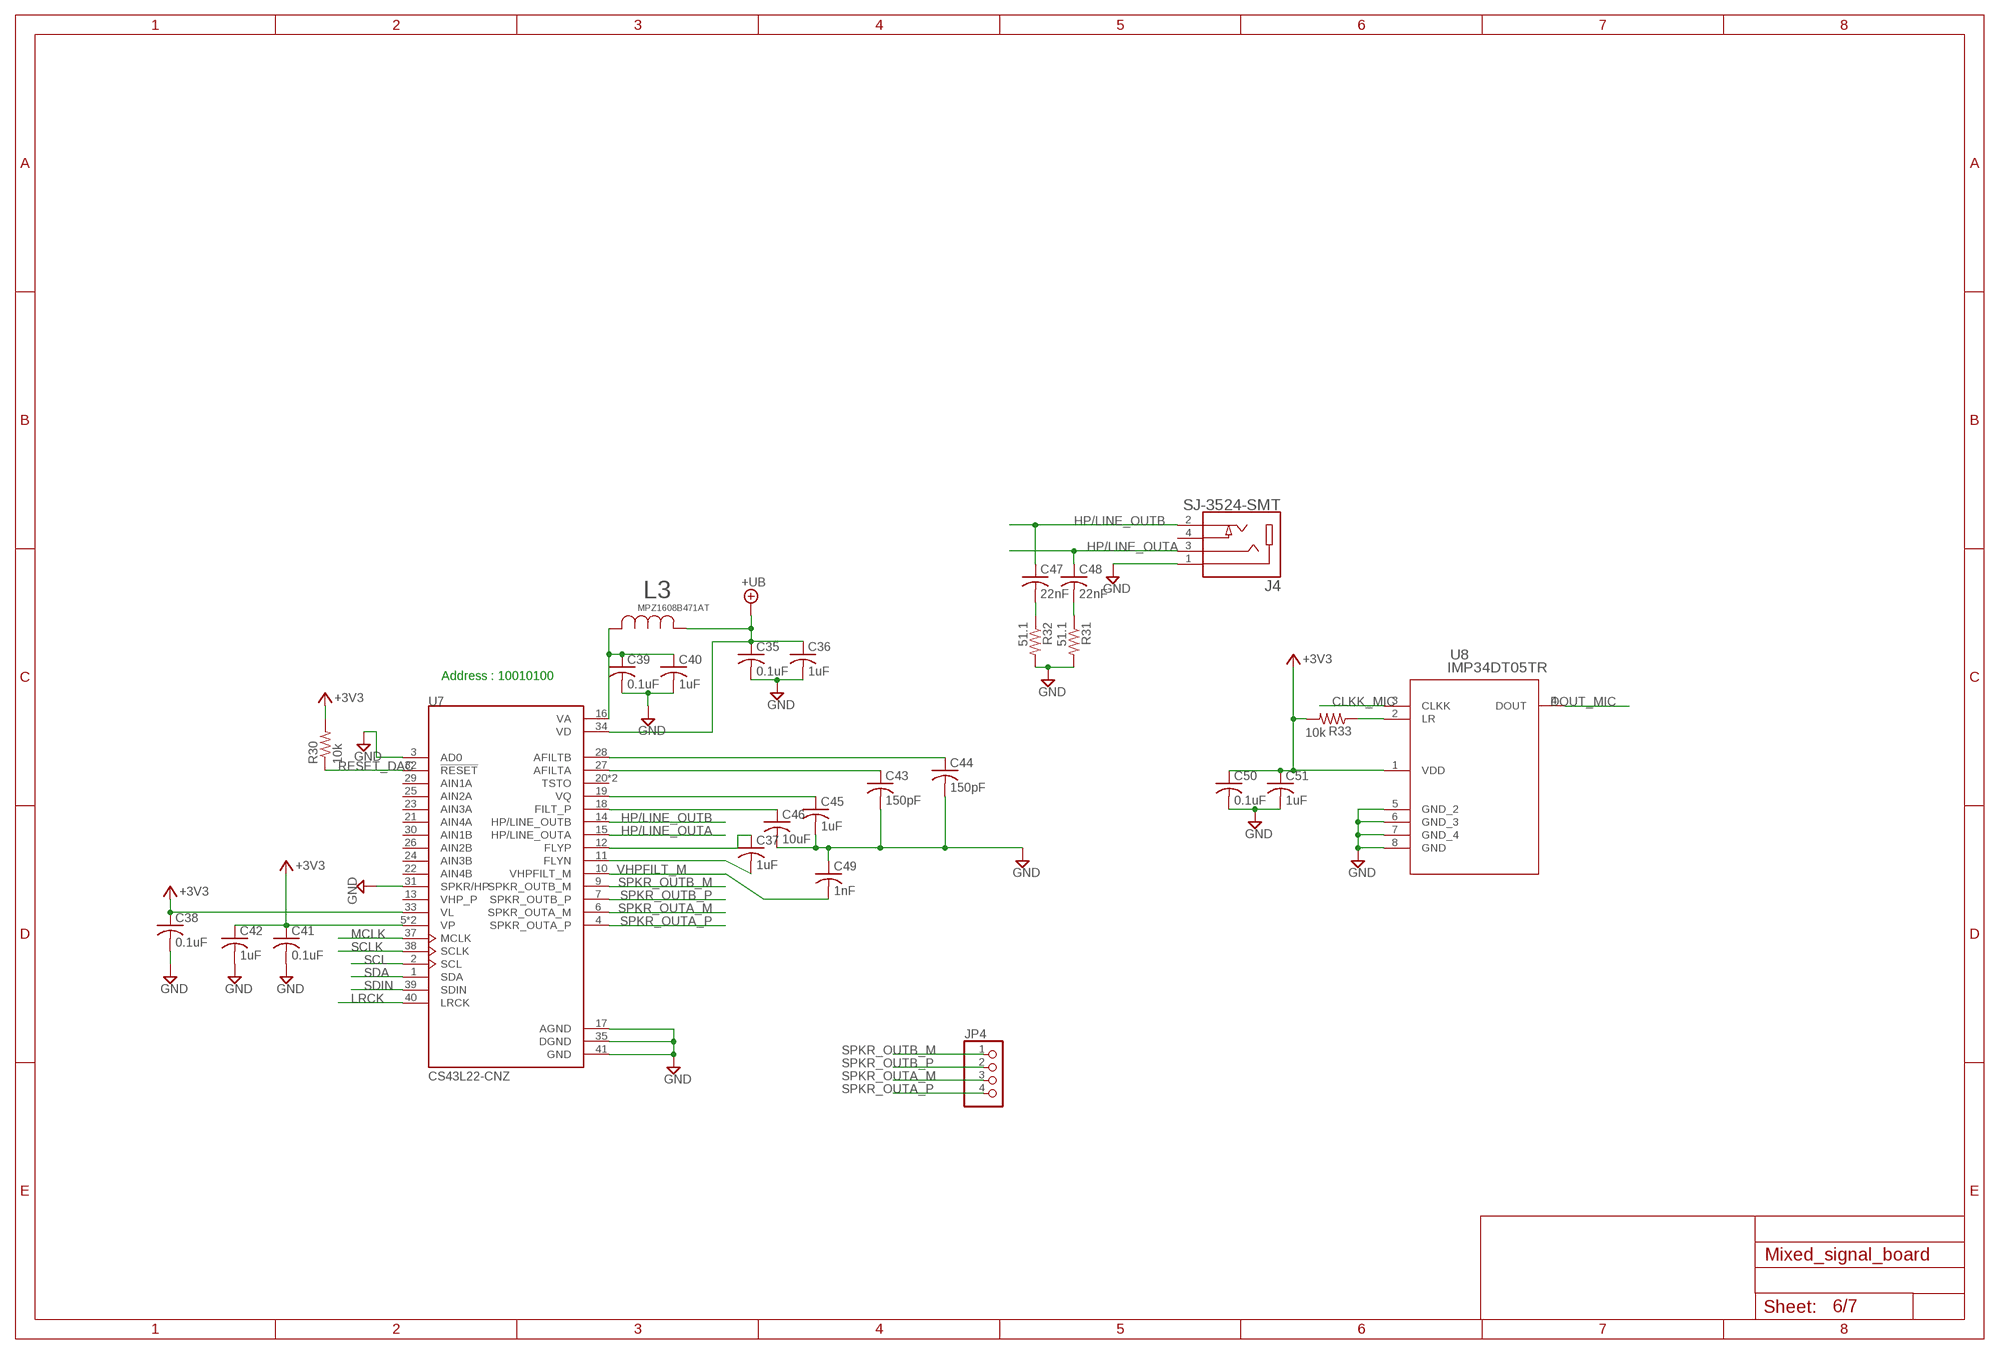
[diagram p5: schematic, sheet 6]

### Parts
C35  0.1uF  C-USC0805  [C0805]
C36  1uF  C-USC0805  [C0805]
C37  1uF  C-USC0805  [C0805]
C38  0.1uF  C-USC0805  [C0805]
C39  0.1uF  C-USC0805  [C0805]
C40  1uF  C-USC0805  [C0805]
C41  0.1uF  C-USC0805  [C0805]
C42  1uF  C-USC0805  [C0805]
C43  150pF  C-USC0805  [C0805]
C44  150pF  C-USC0805  [C0805]
C45  1uF  C-USC0805  [C0805]
C46  10uF  C-USC0805  [C0805]
C47  22nF  C-USC0805  [C0805]
C48  22nF  C-USC0805  [C0805]
C49  1nF  C-USC0805  [C0805]
C50  0.1uF  C-USC0805  [C0805]
C51  1uF  C-USC0805  [C0805]
J4  SJ-3524-SMT  [CUI_SJ-3524-SMT]
JP4  PINHD-1X4  [1X04]
L3  MPZ1608B471AT  [IND_MPZ1608_TDK]
R30  10k  R-US_R0805  [R0805]
R31  51.1  R-US_R0805  [R0805]
R32  51.1  R-US_R0805  [R0805]
R33  10k  R-US_R0805  [R0805]
U7  CS43L22-CNZ  [QFN50P600X600X100-41N]
U8  IMP34DT05TR  [HCLGA_3X4X1_STM]

### Nets
+3V3: C38.1 C41.1 C42.1 C50.1 C51.1 R30.2 R33.2 U7.5(VP) U7.8(VP) U7.33(VL) U8.1(VDD) ; also sheet 1,2,3,4,5,7
+UB: C35.1 C36.1 L3.1 U7.34(VD) ; also sheet 7
CLKK_MIC: U8.3(CLKK) ; also sheet 4
DOUT_MIC: U8.4(DOUT) ; also sheet 4
GND: C35.2 C36.2 C38.2 C39.2 C40.2 C41.2 C42.2 C43.2 C44.2 C45.2 C46.2 C49.1 C50.2 C51.2 J4.1 R31.2 R32.2 U7.3(AD0) U7.17(AGND) U7.31(SPKR/HP) U7.35(DGND) U7.41(GND) U8.5(GND_2) U8.6(GND_3) U8.7(GND_4) U8.8(GND) ; also sheet 1,2,3,4,5,7
HP/LINE_OUTA: C48.1 J4.3 U7.15(HP/LINE_OUTA)
HP/LINE_OUTB: C47.1 J4.2 U7.14(HP/LINE_OUTB)
LRCK: U7.40(LRCK) ; also sheet 4
MCLK: U7.37(MCLK) ; also sheet 4
N$24: C37.1 U7.12(FLYP)
N$25: C37.2 U7.11(FLYN)
N$26: C39.1 C40.1 L3.2 U7.16(VA)
N$27: C43.1 U7.27(AFILTA)
N$28: C44.1 U7.28(AFILTB)
N$29: C45.1 U7.19(VQ)
N$30: C47.2 R32.1
N$31: C46.1 U7.18(FILT_P)
N$32: C48.2 R31.1
N$33: R33.1 U8.2(LR)
RESET_DAC: R30.1 U7.32(!RESET) ; also sheet 4
SCL: U7.2(SCL) ; also sheet 4,5
SCLK: U7.38(SCLK) ; also sheet 4
SDA: U7.1(SDA) ; also sheet 4,5
SDIN: U7.39(SDIN) ; also sheet 4
SPKR_OUTA_M: JP4.3 U7.6(SPKR_OUTA_M)
SPKR_OUTA_P: JP4.4 U7.4(SPKR_OUTA_P)
SPKR_OUTB_M: JP4.1 U7.9(SPKR_OUTB_M)
SPKR_OUTB_P: JP4.2 U7.7(SPKR_OUTB_P)
VHPFILT_M: C49.2 U7.10(VHPFILT_M)
Unconnected: J4.4 U7.13(VHP_P) U7.20(TSTO) U7.21(AIN4A) U7.22(AIN4B) U7.23(AIN3A) U7.24(AIN3B) U7.25(AIN2A) U7.26(AIN2B) U7.29(AIN1A) U7.30(AIN1B) U7.36(TSTO)

### Notes on the sheet
- Address : 10010100

## Sheet 7 of 7
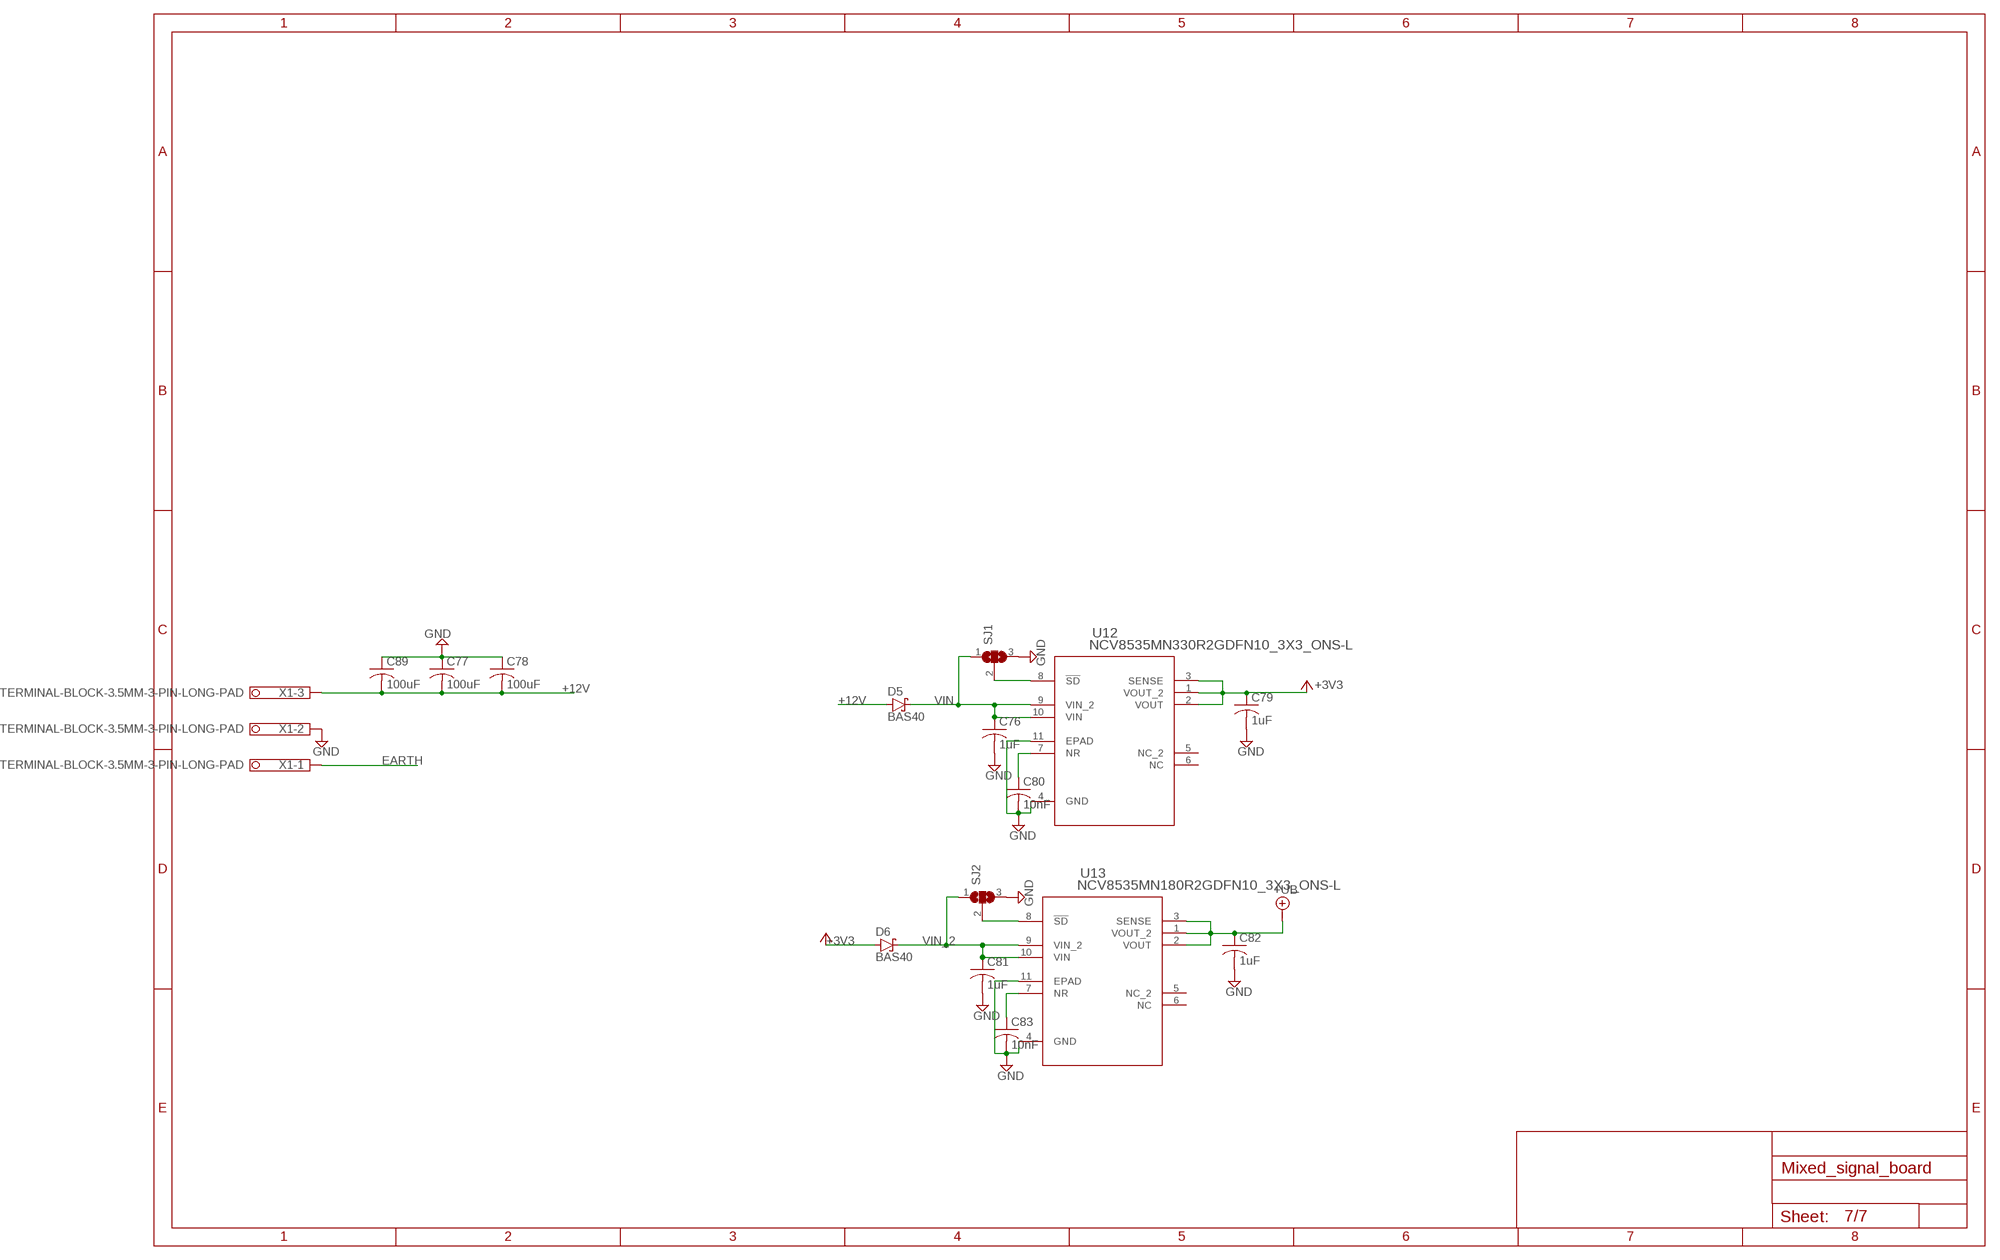
[diagram p6: schematic, sheet 7]

### Parts
C76  1uF  C-USC0805  [C0805]
C77  100uF  C-USC0805  [C0805]
C78  100uF  C-USC0805  [C0805]
C79  1uF  C-USC0805  [C0805]
C80  10nF  C-USC0805  [C0805]
C81  1uF  C-USC0805  [C0805]
C82  1uF  C-USC0805  [C0805]
C83  10nF  C-USC0805  [C0805]
C89  100uF  C-USC0805  [C0805]
D5  BAS40  [SOT23]
D6  BAS40  [SOT23]
SJ1  SJ2WW  [SJ_2W]
SJ2  SJ2WW  [SJ_2W]
U12  NCV8535MN330R2GDFN10_3X3_ONS-L  [DFN10_3X3_ONS-L]
U13  NCV8535MN180R2GDFN10_3X3_ONS-L  [DFN10_3X3_ONS-L]
X1  TERMINAL-BLOCK-3.5MM-3-PIN-LONG-PAD  [TERMINAL-BLOCK-3-PIN-3.5MM-LONG-PAD]

### Nets
+3V3: C79.1 D6.1(A) U12.1(VOUT_2) U12.2(VOUT) U12.3(SENSE) ; also sheet 1,2,3,4,5,6
+12V: C77.2 C78.2 C89.2 D5.1(A) X1.3 ; also sheet 3
+UB: C82.1 U13.1(VOUT_2) U13.2(VOUT) U13.3(SENSE) ; also sheet 6
EARTH: X1.1 ; also sheet 2
GND: C76.2 C77.1 C78.1 C79.2 C80.2 C81.2 C82.2 C83.2 C89.1 SJ1.3 SJ2.3 U12.4(GND) U12.11(EPAD) U13.4(GND) U13.11(EPAD) X1.2 ; also sheet 1,2,3,4,5,6
N$15: SJ1.2 U12.8(!SD)
N$38: C83.1 U13.7(NR)
N$44: SJ2.2 U13.8(!SD)
N$45: C80.1 U12.7(NR)
VIN: C76.1 D5.3(C) SJ1.1 U12.9(VIN_2) U12.10(VIN)
VIN_2: C81.1 D6.3(C) SJ2.1 U13.9(VIN_2) U13.10(VIN)
Unconnected: U12.5(NC_2) U12.6(NC) U13.5(NC_2) U13.6(NC)

## Power pins joined to a net without a drawn wire
VREF+: U9.21(VREF+)

## Library data of the parts
C1-C26 C28-C52 C55-C72 C74-C83 C89 = rcl:C-US: CAPACITOR, American symbol; SPICEPREFIX: C
C27 C73 = 100uF_KCM55WC71E107MH13L:KCM55WC71E107MH13L: Check prices <https://pricing.snapeda.com/parts/KCM55WC71E107MH13L/Murata/view-part?ref=eda>; AVAILABILITY: Warning; DESCRIPTION: SMD Capacitor X7S(EIA) with Capacitance: 100uF Tol. 20%. Rated Voltage: 25Vdc; MF: Murata; MP: KCM55WC71E107MH13L; PACKAGE: 6153 Murata; PRICE: None
C53 C54 = LLA219C70G225MA01L:LLA219C70G225MA01L: Cap Ceramic 2.2uF 4V X7S 20% SMD 0805 125°C Embossed T/R Check prices <https://pricing.snapeda.com/parts/LLA219C70G225MA01L/Murata/view-part?ref=eda>; AVAILABILITY: No availability data; DESCRIPTION: 2.2µF ±20% 4V Ceramic Capacitor X7S 0805 (2012 Metric); MF: Murata; MP: LLA219C70G225MA01L; PACKAGE: 0805 Murata; PRICE: None
D1-D4 = SamacSys_Parts:ESD3V3D9-TP: ESD Suppressors / TVS Diodes Uni-dir 10mA, 3.3V Source: Datasheet <https://componentsearchengine.com/Datasheets/1/ESD3V3D9-TP.pdf>; DESCRIPTION: ESD Suppressors / TVS Diodes Uni-dir 10mA, 3.3V; HEIGHT: 0.43mm; MANUFACTURER_NAME: Micro Commercial Components (MCC); MANUFACTURER_PART_NUMBER: ESD3V3D9-TP; MOUSER_PART_NUMBER: 833-ESD3V3D9-TP; MOUSER_PRICE-STOCK: https://www.mouser.com/Search/Refine.aspx?Keyword=833-ESD3V3D9-TP
D5 D6 = diode:BAS40: Silicon Schottky Diodes General-purpose diode for high-speed switching
J1 J2 = ZX62R-B-5P_30_:ZX62R-B-5P(30): ZX Series 5 Pin Single Port USB 2.0 Micro B Top Mount Receptacle Male; AVAILABILITY: Unavailable; DESCRIPTION: USB - micro B USB 2.0 Receptacle Connector 5 Position Surface Mount, Right Angle; MF: Hirose; MP: ZX62R-B-5P(30); PACKAGE: None; PRICE: None
J4 = SJ-3524-SMT:SJ-3524-SMT: Audio Jack Connector 3.5 mm Low Profile Surface Mount Stereo Jack, 4 Pin Right-Angle; DESCRIPTION: 3.50mm (0.141, 1/8, Mini Plug) - Headphone Phone Jack Stereo (3 Conductor, TRS) Connector Solder; DIGI-KEY_PART_NUMBER: CP-3524SJCT-ND; MF: CUI Devices; MP: SJ-3524-SMT; PACKAGE: None
JP1 = pinhead:PINHD-1X6: PIN HEADER
JP2 JP5 = pinhead:PINHD-1X2: PIN HEADER
JP3 JP4 JP6 JP7 = pinhead:PINHD-1X4: PIN HEADER
L1-L4 = MPZ1608B471ATA00:MPZ1608B471AT; BUILT_BY: EMA_UL_Team; MANUFACTURER_PART_NUMBER: MPZ1608B471AT; SOURCELIBRARY: TDK_2011-01-01_IND_MPZ; VENDOR: TDK
LED1 LED2 = led:LED: LED OSRAM: - CHIPLED LG R971, LG N971, LY N971, LG Q971, LY Q971, LO R971, LY R971 LH N974, LH R974 LS Q976, LO Q976, LY Q976 LO Q996 - Hyper CHIPLED LW Q18S LB Q993, LB Q99A, LB R99A - SideLED LS A670, LO A670, LY A670, LG A670, LP A670 LB A673, LV A673, LT A673, LW A673 LH A674 LY A675 LS A676, LA A676, LO A676, LY A676, LW A676 LS A679, LY A679, LG A679 - Hyper Micro SIDELED® LS Y876, LA Y876, LO Y876, LY Y876 LT Y87S - SmartLED LW L88C, LW L88S LB L89C, LB L89S, LG L890 LS L89K, LO L89K, LY L89K LS L896, LA L896, LO L896, LY L896 - TOPLED LS T670, LO T670, LY T670, LG T670, LP T670 LSG T670, LSP T670, LSY T670, LOP T670, LYG T670 LG T671, LOG T671, LSG T671 LB T673, LV T673, LT T673, LW T673 LH T674 LS T676, LA T676, LO T676, LY T676, LB T676, LH T676, LSB T676, LW T676 LB T67C, LV T67C, LT T67C, LS T67K, LO T67K, LY T67K, LW E67C LS E67B, LA E67B, LO E67B, LY E67B, LB E67C, LV E67C, LT E67C LW T67C LS T679, LY T679, LG T679 LS T770, LO T770, LY T770, LG T770, LP T770 LB T773, LV T773, LT T773, LW T773 LH T774 LS E675, LA E675, LY E675, LS T675 LS T776, LA T776, LO T776, LY T776, LB T776 LHGB T686 LT T68C, LB T68C - Hyper Mini TOPLED® LB M676 - Mini TOPLED Santana® LG M470 LS M47K, LO M47K, LY M47K Source: http://www.osram.convergy.de LUXEON: - LUMILED® LXK2-PW12-R00, LXK2-PW12-S00, LXK2-PW14-U00, LXK2-PW14-V00 LXK2-PM12-R00, LXK2-PM12-S00, LXK2-PM14-U00 LXK2-PE12-Q00, LXK2-PE12-R00, LXK2-PE12-S00, LXK2-PE14-T00, LXK2-PE14-U00 LXK2-PB12-K00, LXK2-PB12-L00, LXK2-PB12-M00, LXK2-PB14-N00, LXK2-PB14-P00, LXK2-PB14-Q00 LXK2-PR12-L00, LXK2-PR12-M00, LXK2-PR14-Q00, LXK2-PR14-R00 LXK2-PD12-Q00, LXK2-PD12-R00, LXK2-PD12-S00 LXK2-PH12-R00, LXK2-PH12-S00 LXK2-PL12-P00, LXK2-PL12-Q00, LXK2-PL12-R00 Source: www.luxeon.com KINGBRIGHT: KA-3528ASYC Source: www.kingbright.com
R1-R33 R35-R49 = rcl:R-US_: RESISTOR, American symbol; SPICEPREFIX: R
S1-S3 = SamacSys_Parts:TL3145AF180QJ: Tactile Switches 50mA 12VDC, 3.5mm 180gf, J lead, IP67 Source: Datasheet; DESCRIPTION: Tactile Switches 50mA 12VDC, 3.5mm 180gf, J lead, IP67; HEIGHT: 3.5mm; MANUFACTURER_NAME: E-Switch; MANUFACTURER_PART_NUMBER: TL3145AF180QJ; MOUSER_PART_NUMBER: 612-TL3145AF180QJ; MOUSER_PRICE-STOCK: https://www.mouser.co.uk/ProductDetail/E-Switch/TL3145AF180QJ?qs=W%2FMpXkg%252BdQ5k47LpZhudJA%3D%3D
SJ1 SJ2 = jumper:SJ2W: SMD solder JUMPER
U1 = STM32F103CBT6:STM32F103CBT6: Mainstream Performance line, ARM Cortex-M3 MCU with 128 Kbytes Flash, 72 MHz CPU, motor control, USB and CAN Check prices <https://pricing.snapeda.com/parts/STM32F103CBT6/STMicroelectronics/view-part?ref=eda>; AVAILABILITY: Warning; DESCRIPTION: ARM® Cortex®-M3 STM32F1 Microcontroller IC 32-Bit 72MHz 128KB (128K x 8) FLASH; MF: STMicroelectronics; MP: STM32F103CBT6; PACKAGE: LQFP-48 STMicroelectronics; PRICE: None; PURCHASE-URL: https://pricing.snapeda.com/search/part/STM32F103CBT6/?ref=eda
U2 = DP83826IRHBR:DP83826IRHBR; BUILT_BY: EMA_Cory; COPYRIGHT: Copyright (C) 2018 Accelerated Designs. All rights reserved; DATASHEET: https://www.ti.com/lit/ds/symlink/dp83826i.pdf?&ts=1589470280978; MANUFACTURER_PART_NUMBER: DP83826IRHBR; SOURCELIBRARY: TI_2020-05-14; VENDOR: Texas Instruments
U4 U11 = DMHT6016LFJ13:DMHT6016LFJ-13; BUILT_BY: EMA_Matt; COPYRIGHT: Copyright (C) 2018 Accelerated Designs. All rights reserved; MANUFACTURER_PART_NUMBER: DMHT6016LFJ-13; SOURCELIBRARY: Diodes_Inc_2019-12-05; VENDOR: Diodes Inc
U5 = CH340C:CH340C; AVAILABILITY: Unavailable; DESCRIPTION: USB to serial chip CH340; MF: WCH; MP: CH340C; PACKAGE: Package; PRICE: None
U6 = ADS122C04IPWR:ADS122C04IPWR: Check prices <https://pricing.snapeda.com/parts/ADS122C04IPWR/Texas%20Instruments/view-part?ref=eda>; AVAILABILITY: Warning; DESCRIPTION: 24-bit, 2-kSPS, 4-ch, low-power, small-size delta-sigma ADC with PGA, VREF, 2x IDACs & I2C interface 16-TSSOP -40 to 125; MF: Texas Instruments; MP: ADS122C04IPWR; PACKAGE: TSSOP-16 Texas Instruments; PRICE: None; PURCHASE-URL: https://pricing.snapeda.com/search/part/ADS122C04IPWR/?ref=eda
U7 = CS43L22-CNZ:CS43L22-CNZ: The CS43L22 is a highly integrated, low power stereo DAC with headphone and Class D speaker amplifiers. The CS43L22 offers many features suitable for low power, portable system applications. The DAC output path includes a digital signal processing engine with various fixed function controls. Tone Control provides bass and treble adjustment of four selectable corner frequencies. Digital Volume controls may be configured to change on soft ramp transitions while the analog controls can be configured to occur on every zero crossing. The DAC also includes de-emphasis, limiting functions and a BEEP generator delivering tones selectable across a range of two full octaves. Check prices <https://pricing.snapeda.com/parts/CS43L22-CNZ/Cirrus%20Logic/view-part?ref=eda>; AVAILABILITY: Bad; DESCRIPTION: DAC, Audio 24 b 96k I²S 40-QFN (6x6); MF: Cirrus Logic; MP: CS43L22-CNZ; PACKAGE: QFN-40 Cirrus Logic; PRICE: None
U8 = IMP34DT05TR:IMP34DT05TR; BUILT_BY: EMA_UL_Team; COPYRIGHT: Copyright (C) 2018 Accelerated Designs. All rights reserved; MANUFACTURER_PART_NUMBER: IMP34DT05TR; SOURCELIBRARY: Updates_to_database_2020-11-03; VENDOR: STMicroelectronics
U9 = STM32F407VGT6:STM32F407VGT6: STM32 Series 32-bit 1 MB Flash 192 kB RAM ARM Based Microcontroller - LQFP-100 Check prices <https://pricing.snapeda.com/parts/STM32F407VGT6/STMicroelectronics/view-part?ref=eda>; AVAILABILITY: Warning; DESCRIPTION: ARM® Cortex®-M4 STM32F4 Microcontroller IC 32-Bit 168MHz 1MB (1M x 8) FLASH 100-LQFP (14x14); MF: STMicroelectronics; MP: STM32F407VGT6; PACKAGE: LQFP-100 STMicroelectronics; PRICE: None; PURCHASE-URL: https://pricing.snapeda.com/search/part/STM32F407VGT6/?ref=eda
U10 U14 = DRV8701ERGER:TEXAS_INSTRUMENTS_DRV8701ERGER: Brushed DC Motor Full-Bridge Gate Driver 24-VQFN (4x4); AMBIENT_TEMPERATURE_RANGE_HIGH: +125°C; AMBIENT_TEMPERATURE_RANGE_LOW: -40°C; AUTOMOTIVE: No; CENTROID_NOT_SPECIFIED: No; DATASHEET: https://www.ti.com/lit/gpn/DRV8701; DEVICE_CLASS_L1: Integrated Circuits (ICs); DEVICE_CLASS_L2: Power Management ICs; DEVICE_CLASS_L3: Motor Drivers; DIGIKEY_DESCRIPTION: IC MOTOR DRIVER 0V-5.5V 24VQFN; DIGIKEY_PART_NUMBER: 296-46292-1-ND; FOOTPRINT_PARAMETERS_1: {"fp_type":"QFN","params":{"N1":{"nom":6,"long name":"Leads on long side","min":null,"max":null,"short name":"N1","type":"count"},"N2":{"nom":6,"long name":"Leads on wide side","min":null,"max":null,"short name":"N2","type":"count"},"A":{"nom":false,"long name":"Height","min":false,"max":1000000,"short name":"A","type":"measurement"},"A1":{"nom":25000,"long name":"Package clearance","min":0,"max":50000,"short name":"A1","type":"measurement"},"A2":{"nom":false,"long name":"Package height","min":false,"max":1000000,"short name":"A2","type":"measurement"},"D":{"nom":4000000,"long name":"Package length","min":3900000,"max":4099999,"short name":"D","type":"measurement"},"E":{"nom":4000000,"long name":"Package width","min":3900000,"max":4099999,"short name":"E","type":"measurement"},"B":{"nom":240000,"long name":"Lead width","min":180000,"max":300000,"short name":"B","type":"measurement"},"C":{"nom":200000,"long name":"Lead thickness","min":null,"max":null,"short name":"C","type":"measurement"},"L":{"nom":400000,"long name":"Lead foot length","min":300000,"max":500000,"short name":"L","type":"measurement"},"e":{"nom":500000,"long name":"Lead pitch","min":null,"max":null,"short name":"e","type":"measurement"},"HT":{"default":"Yes","long name":"Thermal pad","type":"multichoiceparent","short name":"HT","children":["D2","E2","PC"]},"offset x":{"nom":0,"long name":"X Center offset","min":null,"max":null,"short name":"offset x","type":"measurement"},"offset y":{"nom":0,"long name":"Y Center offset","min":null,"max":null,"short name":"offset y","type":"measurement"},"LS":{"default":"Rounded rectangle","long name":"Land shape","type":"multichoice","short name":"LS"},"LS1":{"default":"Rectangle","long name":"Land shape (Pin 1)","type":"multichoice","short name":"LS1"},"solder toe":{"nom":400000,"long name":"Solder fillet (toe)","min":null,"max":null,"short name":"solder toe","type":"fixedmeasurement"},"solder heel":{"nom":0,"long name":"Solder fillet (heel)","min":null,"max":null,"short name":"solder heel","type":"fixedmeasurement"},"solder side":{"nom":-40000,"long name":"Solder fillet (side)","min":null,"max":null,"short name":"solder side","type":"fixedmeasurement"},"courtyard":{"nom":500000,"long name":"Courtyard","min":null,"max":null,"short name":"courtyard","type":"fixedmeasurement"},"SF":{"default":"A","long name":"Packing level","type":"multichoiceparent","short name":"SF","help":"http://support.upverter.com/customer/portal/articles/978783-what-is-a-footprint-packing-level","children":["solder toe","solder heel","solder side","courtyard"]},"D2":{"nom":2800000,"long name":"Thermal pad length","min":2700000,"max":2900000,"short name":"D2","type":"measurement"},"E2":{"nom":2800000,"long name":"Thermal pad width","min":2700000,"max":2900000,"short name":"E2","type":"measurement"},"PC":{"long name":"Paste coverage (%)","type":"percentage","short name":"PC","value":40}}}; FOOTPRINT_PARAMETERS_2: {"fp_type":"QFN","params":{"N1":{"nom":6,"long name":"Leads on long side","min":null,"max":null,"short name":"N1","type":"count"},"N2":{"nom":6,"long name":"Leads on wide side","min":null,"max":null,"short name":"N2","type":"count"},"A":{"nom":false,"long name":"Height","min":false,"max":1000000,"short name":"A","type":"measurement"},"A1":{"nom":25000,"long name":"Package clearance","min":0,"max":50000,"short name":"A1","type":"measurement"},"A2":{"nom":false,"long name":"Package height","min":false,"max":1000000,"short name":"A2","type":"measurement"},"D":{"nom":4000000,"long name":"Package length","min":3900000,"max":4099999,"short name":"D","type":"measurement"},"E":{"nom":4000000,"long name":"Package width","min":3900000,"max":4099999,"short name":"E","type":"measurement"},"B":{"nom":240000,"long name":"Lead width","min":180000,"max":300000,"short name":"B","type":"measurement"},"C":{"nom":200000,"long name":"Lead thickness","min":null,"max":null,"short name":"C","type":"measurement"},"L":{"nom":400000,"long name":"Lead foot length","min":300000,"max":500000,"short name":"L","type":"measurement"},"e":{"nom":500000,"long name":"Lead pitch","min":null,"max":null,"short name":"e","type":"measurement"},"D2":{"nom":2800000,"long name":"Thermal pad length","min":2700000,"max":2900000,"short name":"D2","type":"measurement"},"E2":{"nom":2800000,"long name":"Thermal pad width","min":2700000,"max":2900000,"short name":"E2","type":"measurement"},"PC":{"long name":"Paste coverage (%)","type":"percentage","short name":"PC","value":40},"HT":{"default":"Yes","long name":"Thermal pad","type":"multichoiceparent","short name":"HT","children":["D2","E2","PC"]},"offset x":{"nom":0,"long name":"X Center offset","min":null,"max":null,"short name":"offset x","type":"measurement"},"offset y":{"nom":0,"long name":"Y Center offset","min":null,"max":null,"short name":"offset y","type":"measurement"},"LS":{"default":"Rounded rectangle","long name":"Land shape","type":"multichoice","short name":"LS"},"LS1":{"default":"Rectangle","long name":"Land shape (Pin 1)","type":"multichoice","short name":"LS1"},"solder toe":{"nom":300000,"long name":"Solder fillet (toe)","min":null,"max":null,"short name":"solder toe","type":"fixedmeasurement"},"solder heel":{"nom":0,"long name":"Solder fillet (heel)","min":null,"max":null,"short name":"solder heel","type":"fixedmeasurement"},"solder side":{"nom":-40000,"long name":"Solder fillet (side)","min":null,"max":null,"short name":"solder side","type":"fixedmeasurement"},"courtyard":{"nom":250000,"long name":"Courtyard","min":null,"max":null,"short name":"courtyard","type":"fixedmeasurement"},"SF":{"default":"B","long name":"Packing level","type":"multichoiceparent","short name":"SF","help":"http://support.upverter.com/customer/portal/articles/978783-what-is-a-footprint-packing-level","children":["solder toe","solder heel","solder side","courtyard"]}}}; FOOTPRINT_PARAMETERS_3: {"fp_type":"QFN","params":{"N1":{"nom":6,"long name":"Leads on long side","min":null,"max":null,"short name":"N1","type":"count"},"N2":{"nom":6,"long name":"Leads on wide side","min":null,"max":null,"short name":"N2","type":"count"},"A":{"nom":false,"long name":"Height","min":false,"max":1000000,"short name":"A","type":"measurement"},"A1":{"nom":25000,"long name":"Package clearance","min":0,"max":50000,"short name":"A1","type":"measurement"},"A2":{"nom":false,"long name":"Package height","min":false,"max":1000000,"short name":"A2","type":"measurement"},"D":{"nom":4000000,"long name":"Package length","min":3900000,"max":4099999,"short name":"D","type":"measurement"},"E":{"nom":4000000,"long name":"Package width","min":3900000,"max":4099999,"short name":"E","type":"measurement"},"B":{"nom":240000,"long name":"Lead width","min":180000,"max":300000,"short name":"B","type":"measurement"},"C":{"nom":200000,"long name":"Lead thickness","min":null,"max":null,"short name":"C","type":"measurement"},"L":{"nom":400000,"long name":"Lead foot length","min":300000,"max":500000,"short name":"L","type":"measurement"},"e":{"nom":500000,"long name":"Lead pitch","min":null,"max":null,"short name":"e","type":"measurement"},"D2":{"nom":2800000,"long name":"Thermal pad length","min":2700000,"max":2900000,"short name":"D2","type":"measurement"},"E2":{"nom":2800000,"long name":"Thermal pad width","min":2700000,"max":2900000,"short name":"E2","type":"measurement"},"PC":{"long name":"Paste coverage (%)","type":"percentage","short name":"PC","value":40},"HT":{"default":"Yes","long name":"Thermal pad","type":"multichoiceparent","short name":"HT","children":["D2","E2","PC"]},"offset x":{"nom":0,"long name":"X Center offset","min":null,"max":null,"short name":"offset x","type":"measurement"},"offset y":{"nom":0,"long name":"Y Center offset","min":null,"max":null,"short name":"offset y","type":"measurement"},"LS":{"default":"Rounded rectangle","long name":"Land shape","type":"multichoice","short name":"LS"},"LS1":{"default":"Rectangle","long name":"Land shape (Pin 1)","type":"multichoice","short name":"LS1"},"solder toe":{"nom":200000,"long name":"Solder fillet (toe)","min":null,"max":null,"short name":"solder toe","type":"fixedmeasurement"},"solder heel":{"nom":0,"long name":"Solder fillet (heel)","min":null,"max":null,"short name":"solder heel","type":"fixedmeasurement"},"solder side":{"nom":-40000,"long name":"Solder fillet (side)","min":null,"max":null,"short name":"solder side","type":"fixedmeasurement"},"courtyard":{"nom":100000,"long name":"Courtyard","min":null,"max":null,"short name":"courtyard","type":"fixedmeasurement"},"SF":{"default":"C","long name":"Packing level","type":"multichoiceparent","short name":"SF","help":"http://support.upverter.com/customer/portal/articles/978783-what-is-a-footprint-packing-level","children":["solder toe","solder heel","solder side","courtyard"]}}}; FOOTPRINT_VARIANT_NAME_0: Recommended_Land_Pattern; FOOTPRINT_VARIANT_NAME_1: IPC_A; FOOTPRINT_VARIANT_NAME_2: IPC_B; FOOTPRINT_VARIANT_NAME_3: IPC_C; HEIGHT: 1mm; LEAD_FREE: Yes; MAX_JUNCTION_TEMP: +150°C; MAX_SUPPLY_VOLTAGE: 45V; MF: Texas Instruments; MFG_PACKAGE_IDENT: RGE0024F; MFG_PACKAGE_IDENT_COMPONENT_ID: f8ae1afb146ede2f; MFG_PACKAGE_IDENT_DATE: 0; MFG_PACKAGE_IDENT_REV: 0; MIN_SUPPLY_VOLTAGE: 5.9V; MOTOR_TYPE: Brushed; MOUSER_PART_NUMBER: 595-DRV8701ERGER; MPN: DRV8701ERGER; NOMINAL_SUPPLY_CURRENT: 6mA; NUMBER_OF_OUTPUTS: 1; OUTPUT_VOLTAGE: 5.9-45V; PACKAGE: VQFN24; PREFIX: U; ROHS: Yes; STANDOFF_HEIGHT: 0mm; TEMPERATURE_RANGE_HIGH: +125°C; TEMPERATURE_RANGE_LOW: -40°C; VERIFICATION_VERSION: 0.0.0.3
U12 = NCV8535MN330R2G:NCV8535MN330R2G; BUILT_BY: EMA_Jessica; COPYRIGHT: Copyright (C) 2016 Accelerated Designs. All rights reserved; MANUFACTURER_PART_NUMBER: NCV8535MN330R2G; SOURCELIBRARY: ON_Semiconductor_2018-03-21; VENDOR: ON Semiconductor
U13 = NCV8535MN1800R2G:NCV8535MN180R2G; BUILT_BY: EMA_Jessica; COPYRIGHT: Copyright (C) 2016 Accelerated Designs. All rights reserved; MANUFACTURER_PART_NUMBER: NCV8535MN330R2G; SOURCELIBRARY: ON_Semiconductor_2018-03-21; VENDOR: ON Semiconductor
U$1 = RJHSE5080:RJ-45
X1 = Terminal Block 3-5mm v1-0:TERMINAL-BLOCK-3.5MM-3-PIN: Terminal Block 3.5mm Pitch: 3,5 mm Number of pins: 3 Created by Rembrandt Electronics www.rembrandtelectronics.com
Y1 Y3 = ECS-80-32-5PX-TR:ECS-80-32-5PX-TR: CRYSTAL SMD; AVAILABILITY: Unavailable; DESCRIPTION: 8MHz ±30ppm Crystal 32pF 60 Ohms HC-49/US; MF: ECS Inc.; MP: ECS-80-32-5PX-TR; PACKAGE: HC49/US ECS International; PRICE: None
Y2 = FOXSDLF_250F-20:FOXSDLF/250F-20: Microprocessor, Crystal; 16 Mhz; + 30 Ppm @ Degc; 7 Pf (Max.); 20 Pf; -20 Deg Check prices <https://pricing.snapeda.com/parts/FOXSDLF/250F-20/Fox%20Electronics/view-part?ref=eda>; AVAILABILITY: Warning; DESCRIPTION: 25MHz ±30ppm Crystal 20pF 30 Ohms HC-49/US; MF: Fox Electronics; MP: FOXSDLF/250F-20; PACKAGE: HC-49/US Fox Electronics; PRICE: None; PURCHASE-URL: https://pricing.snapeda.com/search/part/FOXSDLF/250F-20/?ref=eda

## Net classes
1 50ohm: width 0.015 mm, drill 0.015 mm, clearance 0.127 mm